# EAGLE design InteractionBoard_temp (EAGLE 9.6.2)
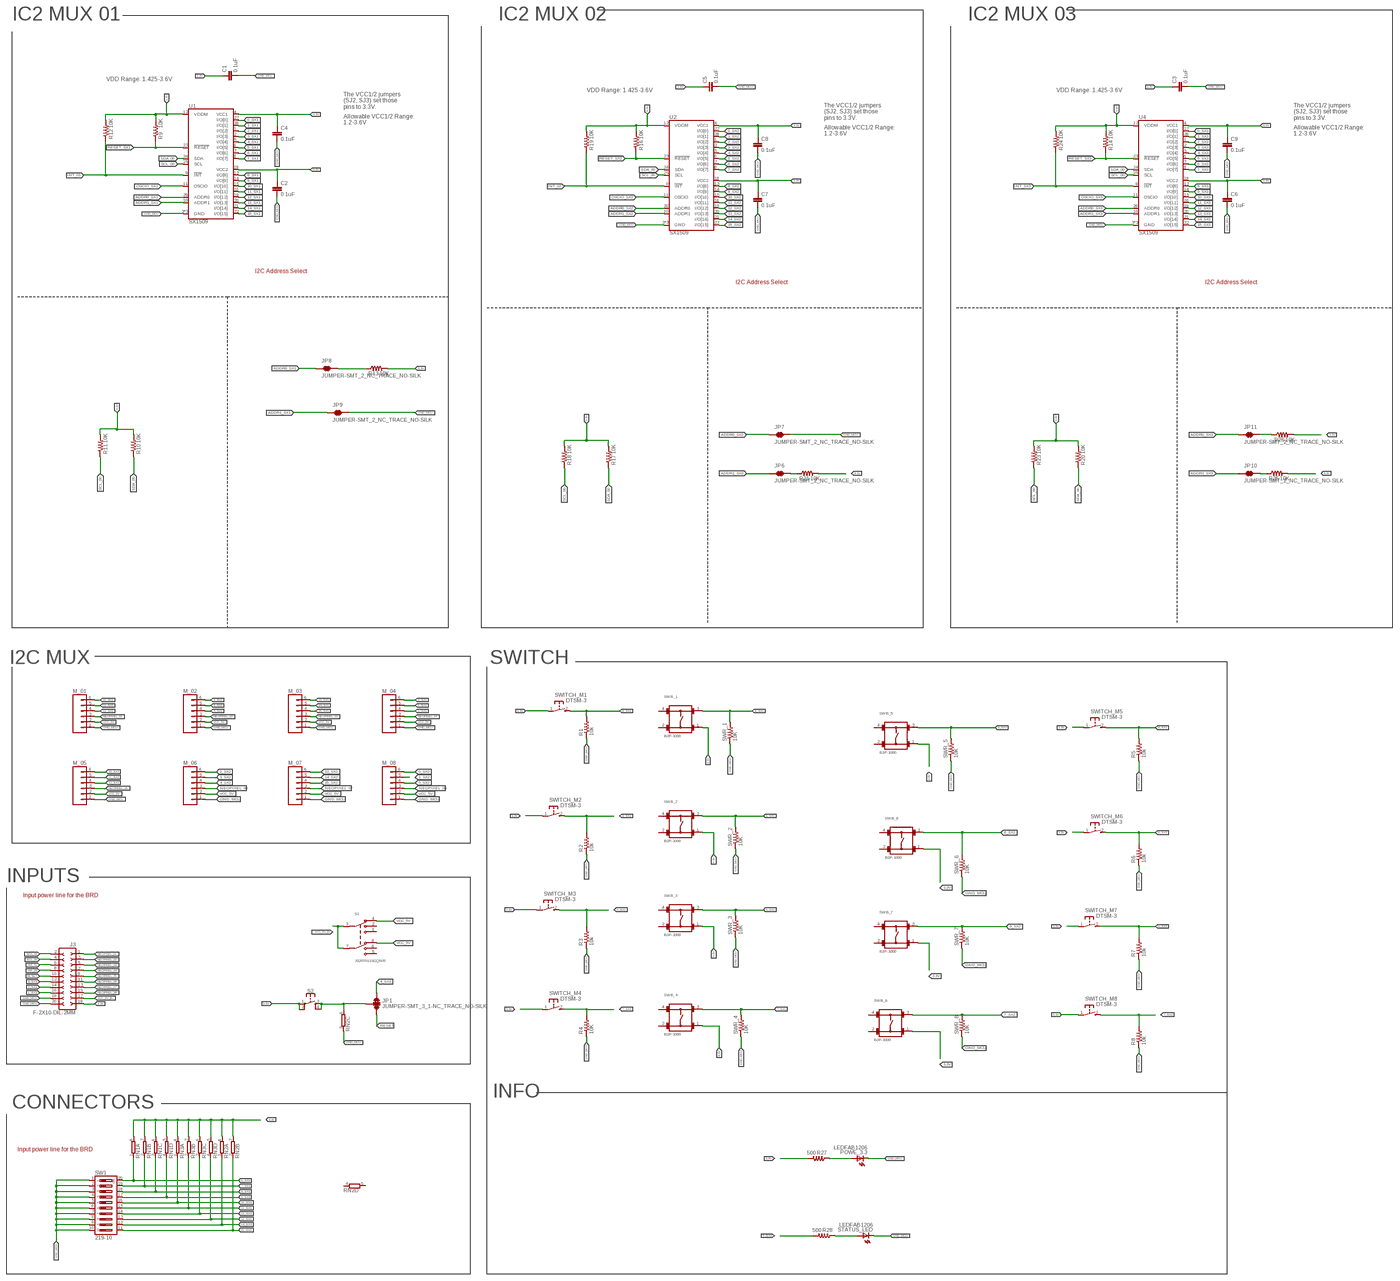
[diagram p0: schematic, sheet 1, overview]
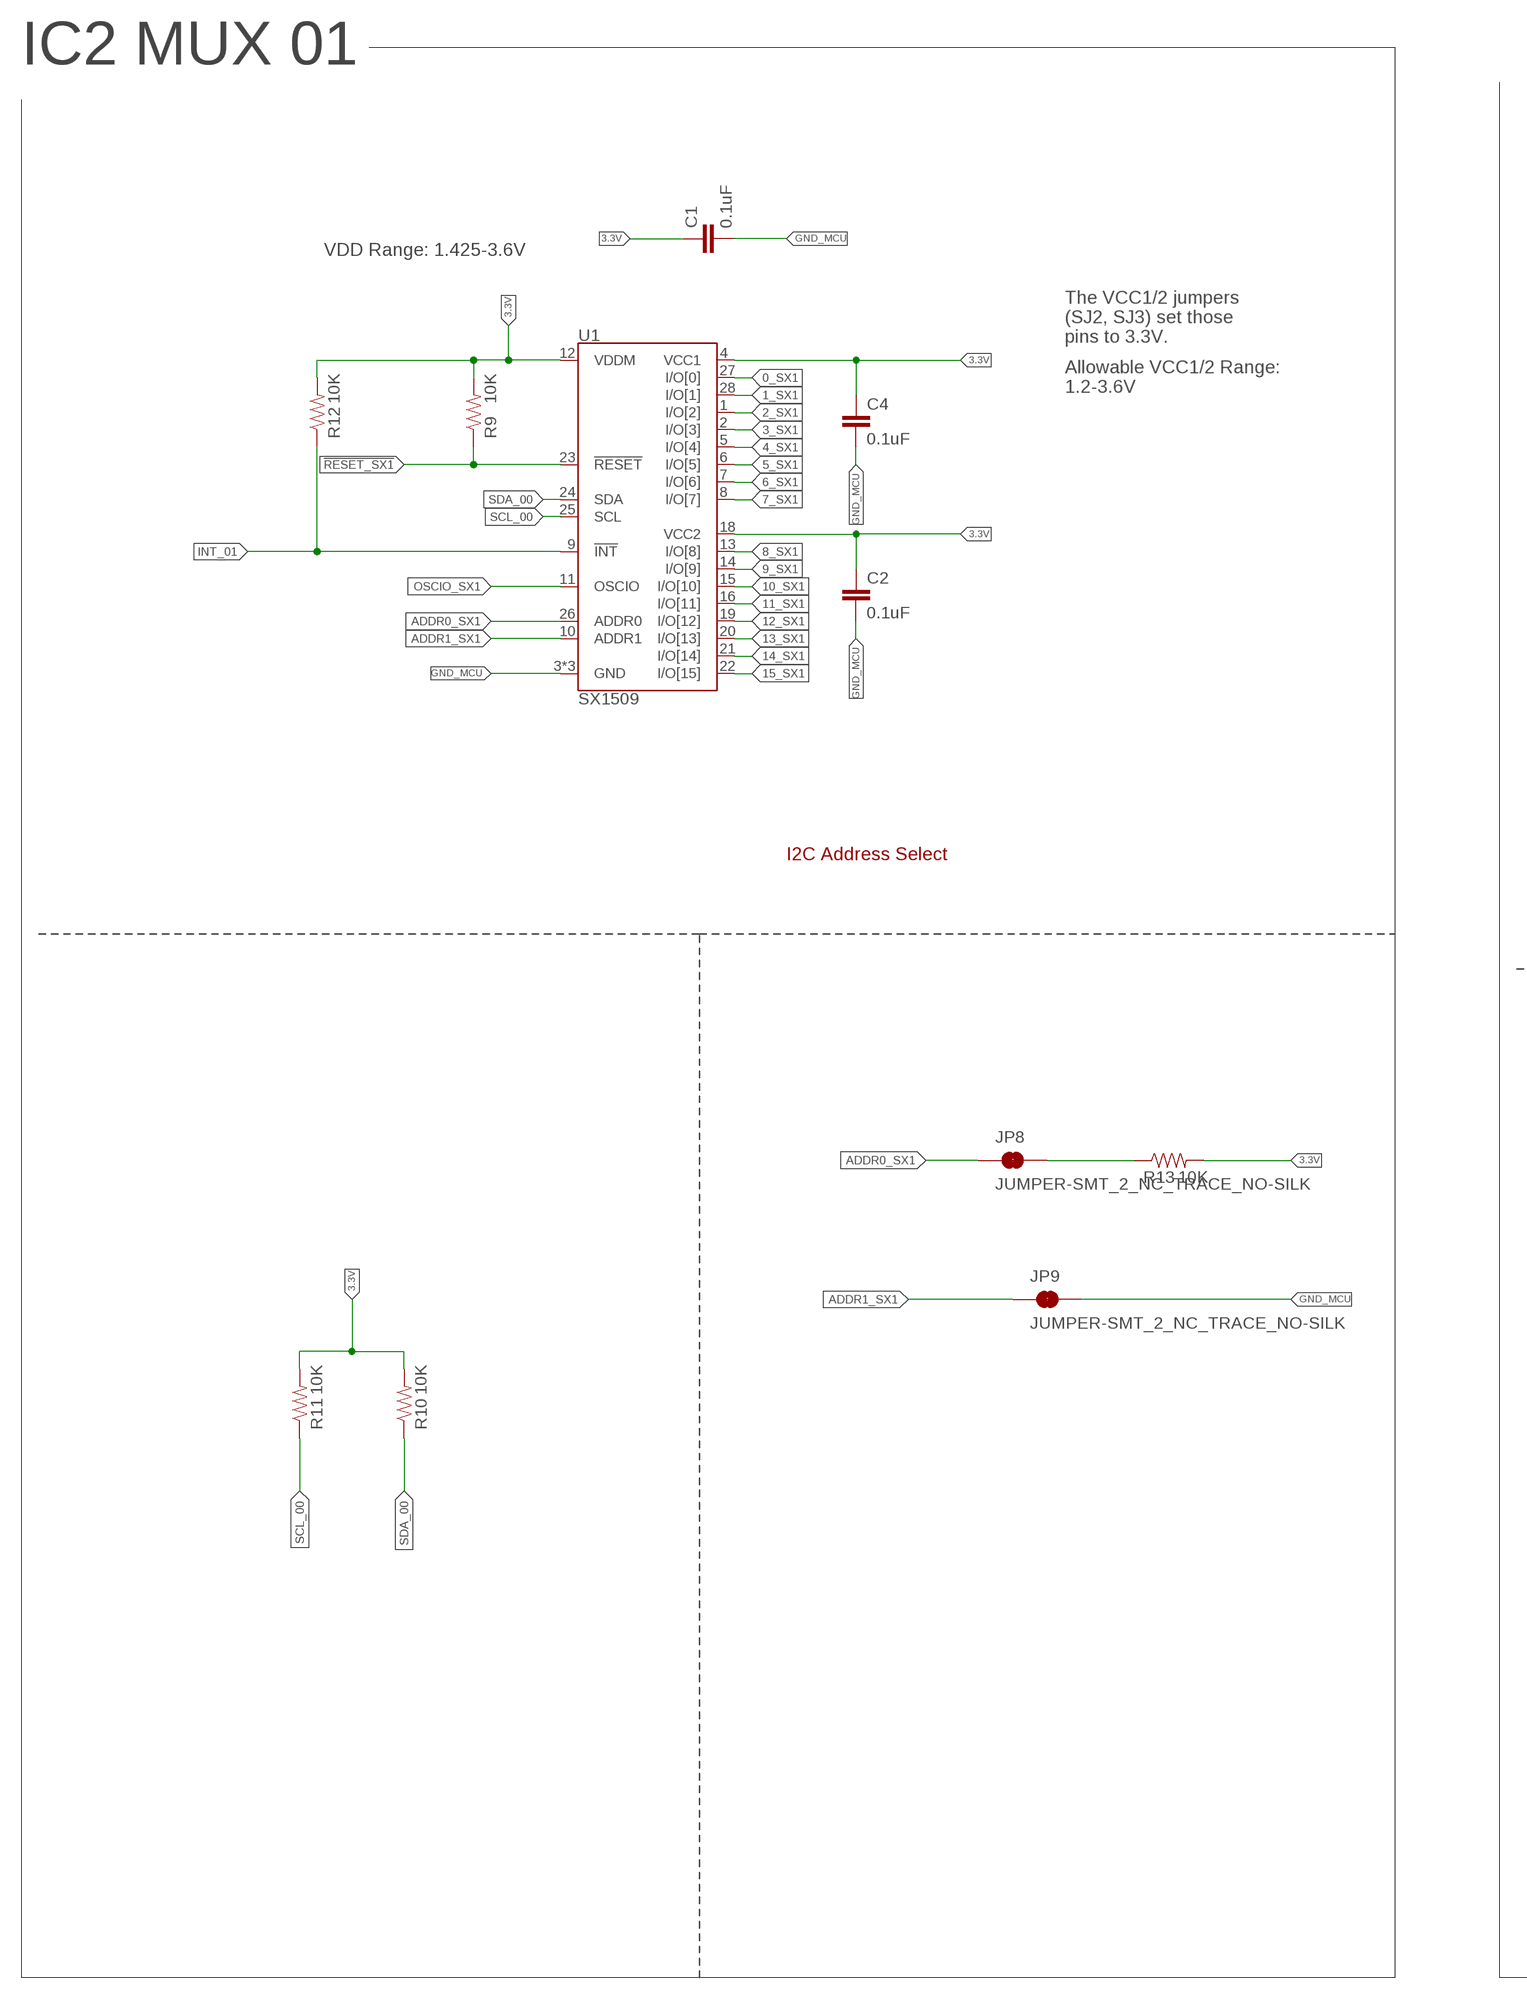
[diagram p1: schematic, sheet 1, part 1 of 4]
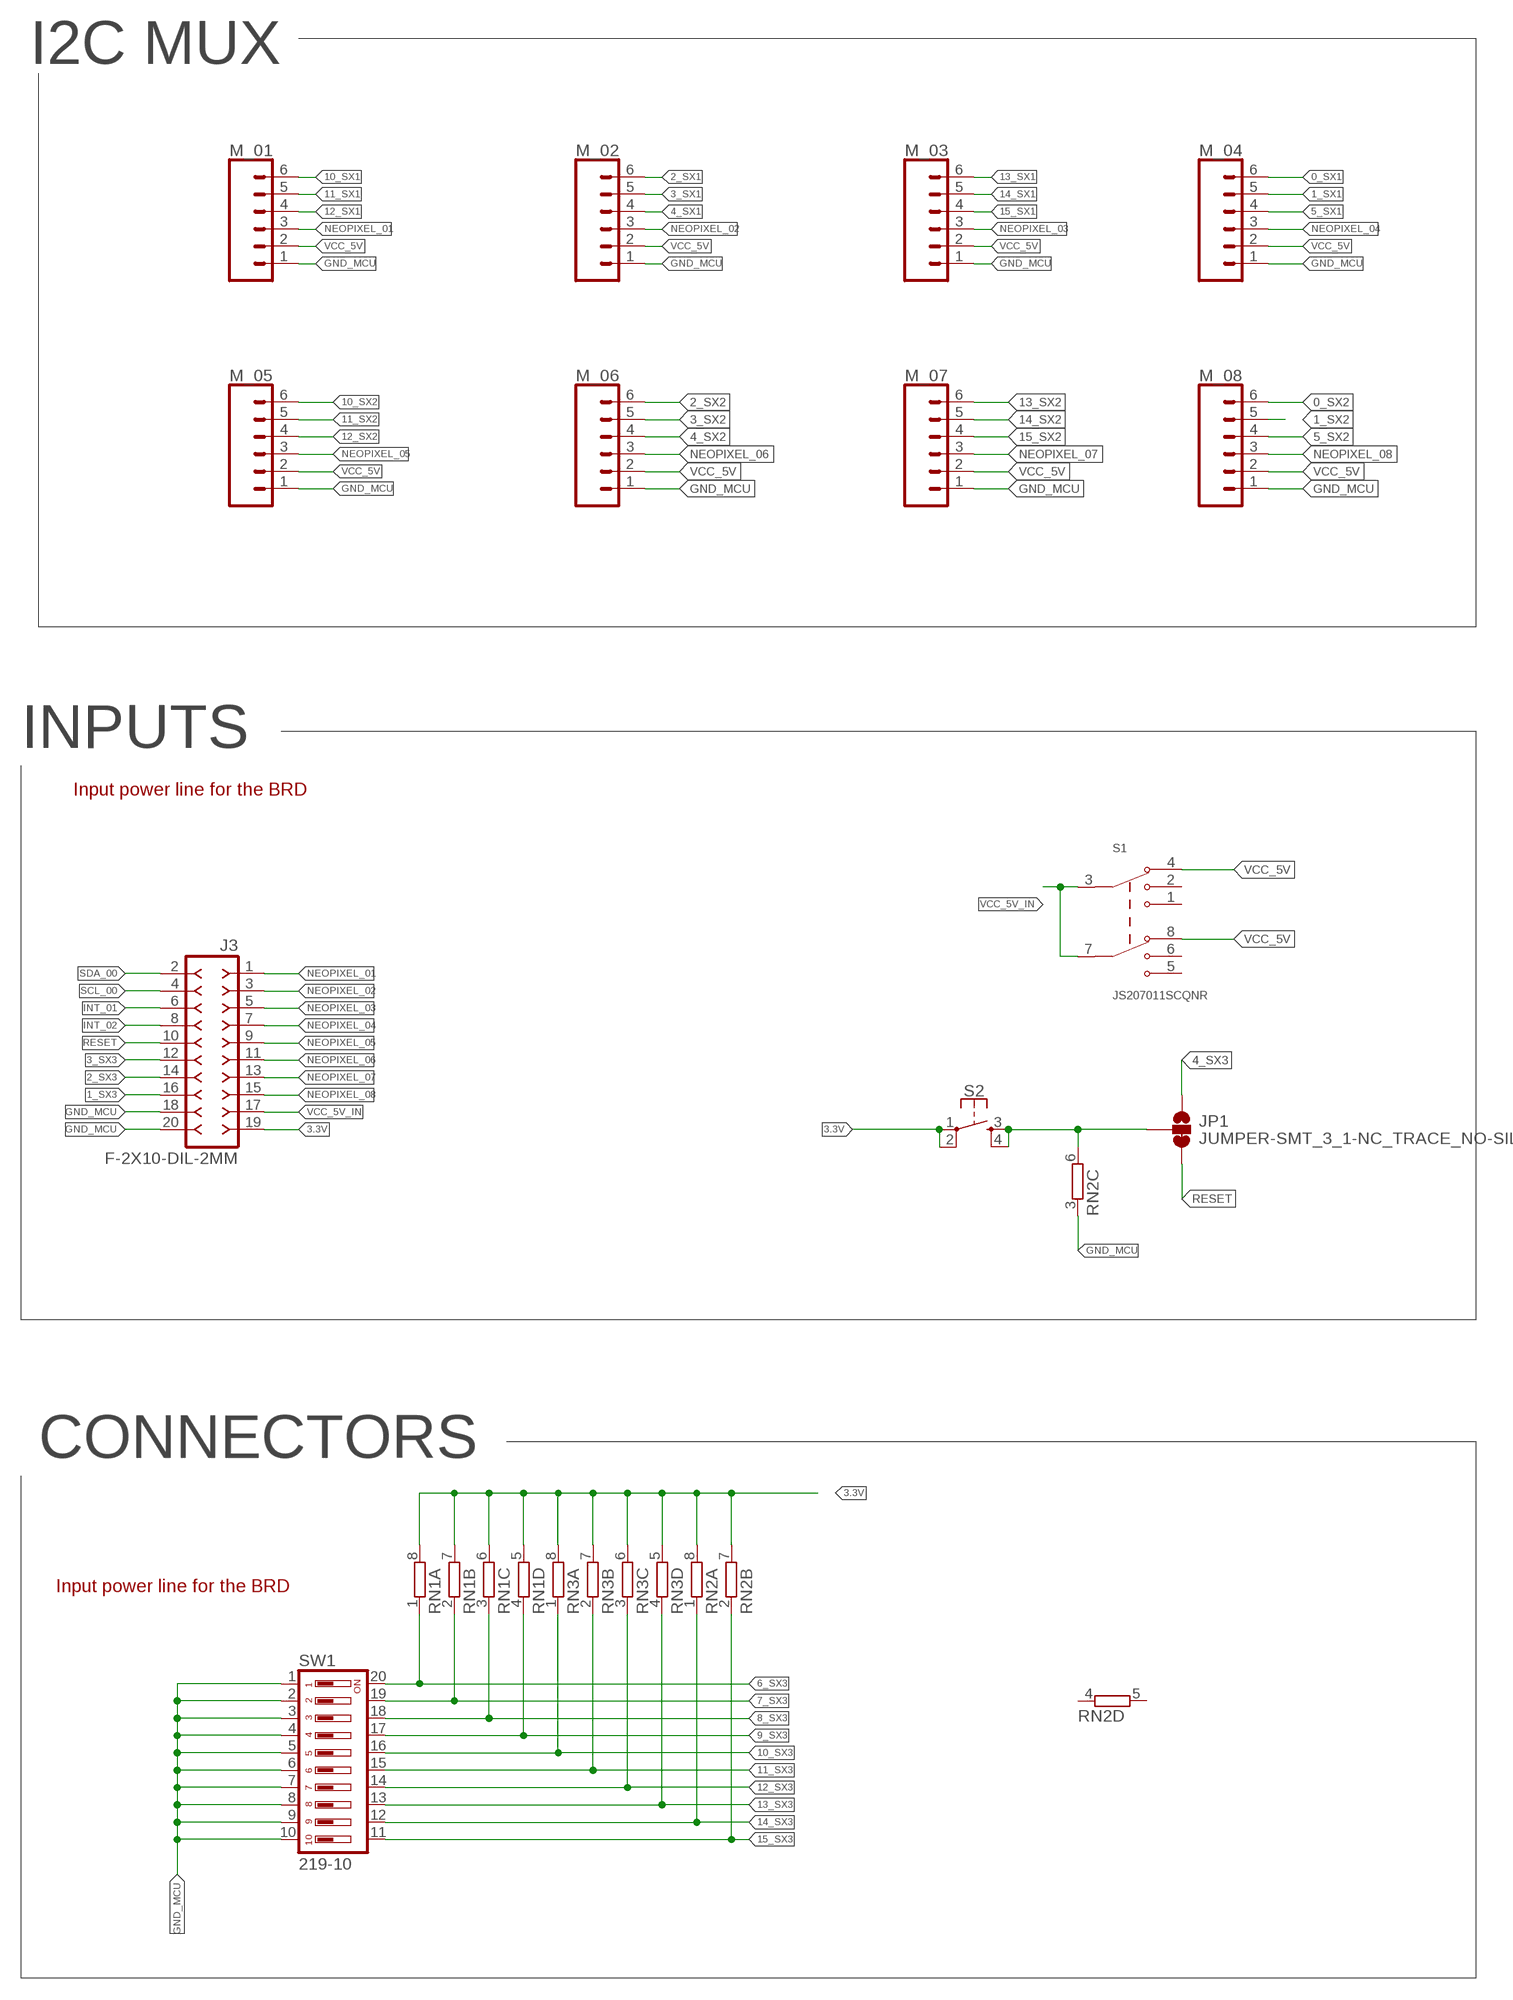
[diagram p2: schematic, sheet 1, part 2 of 4]
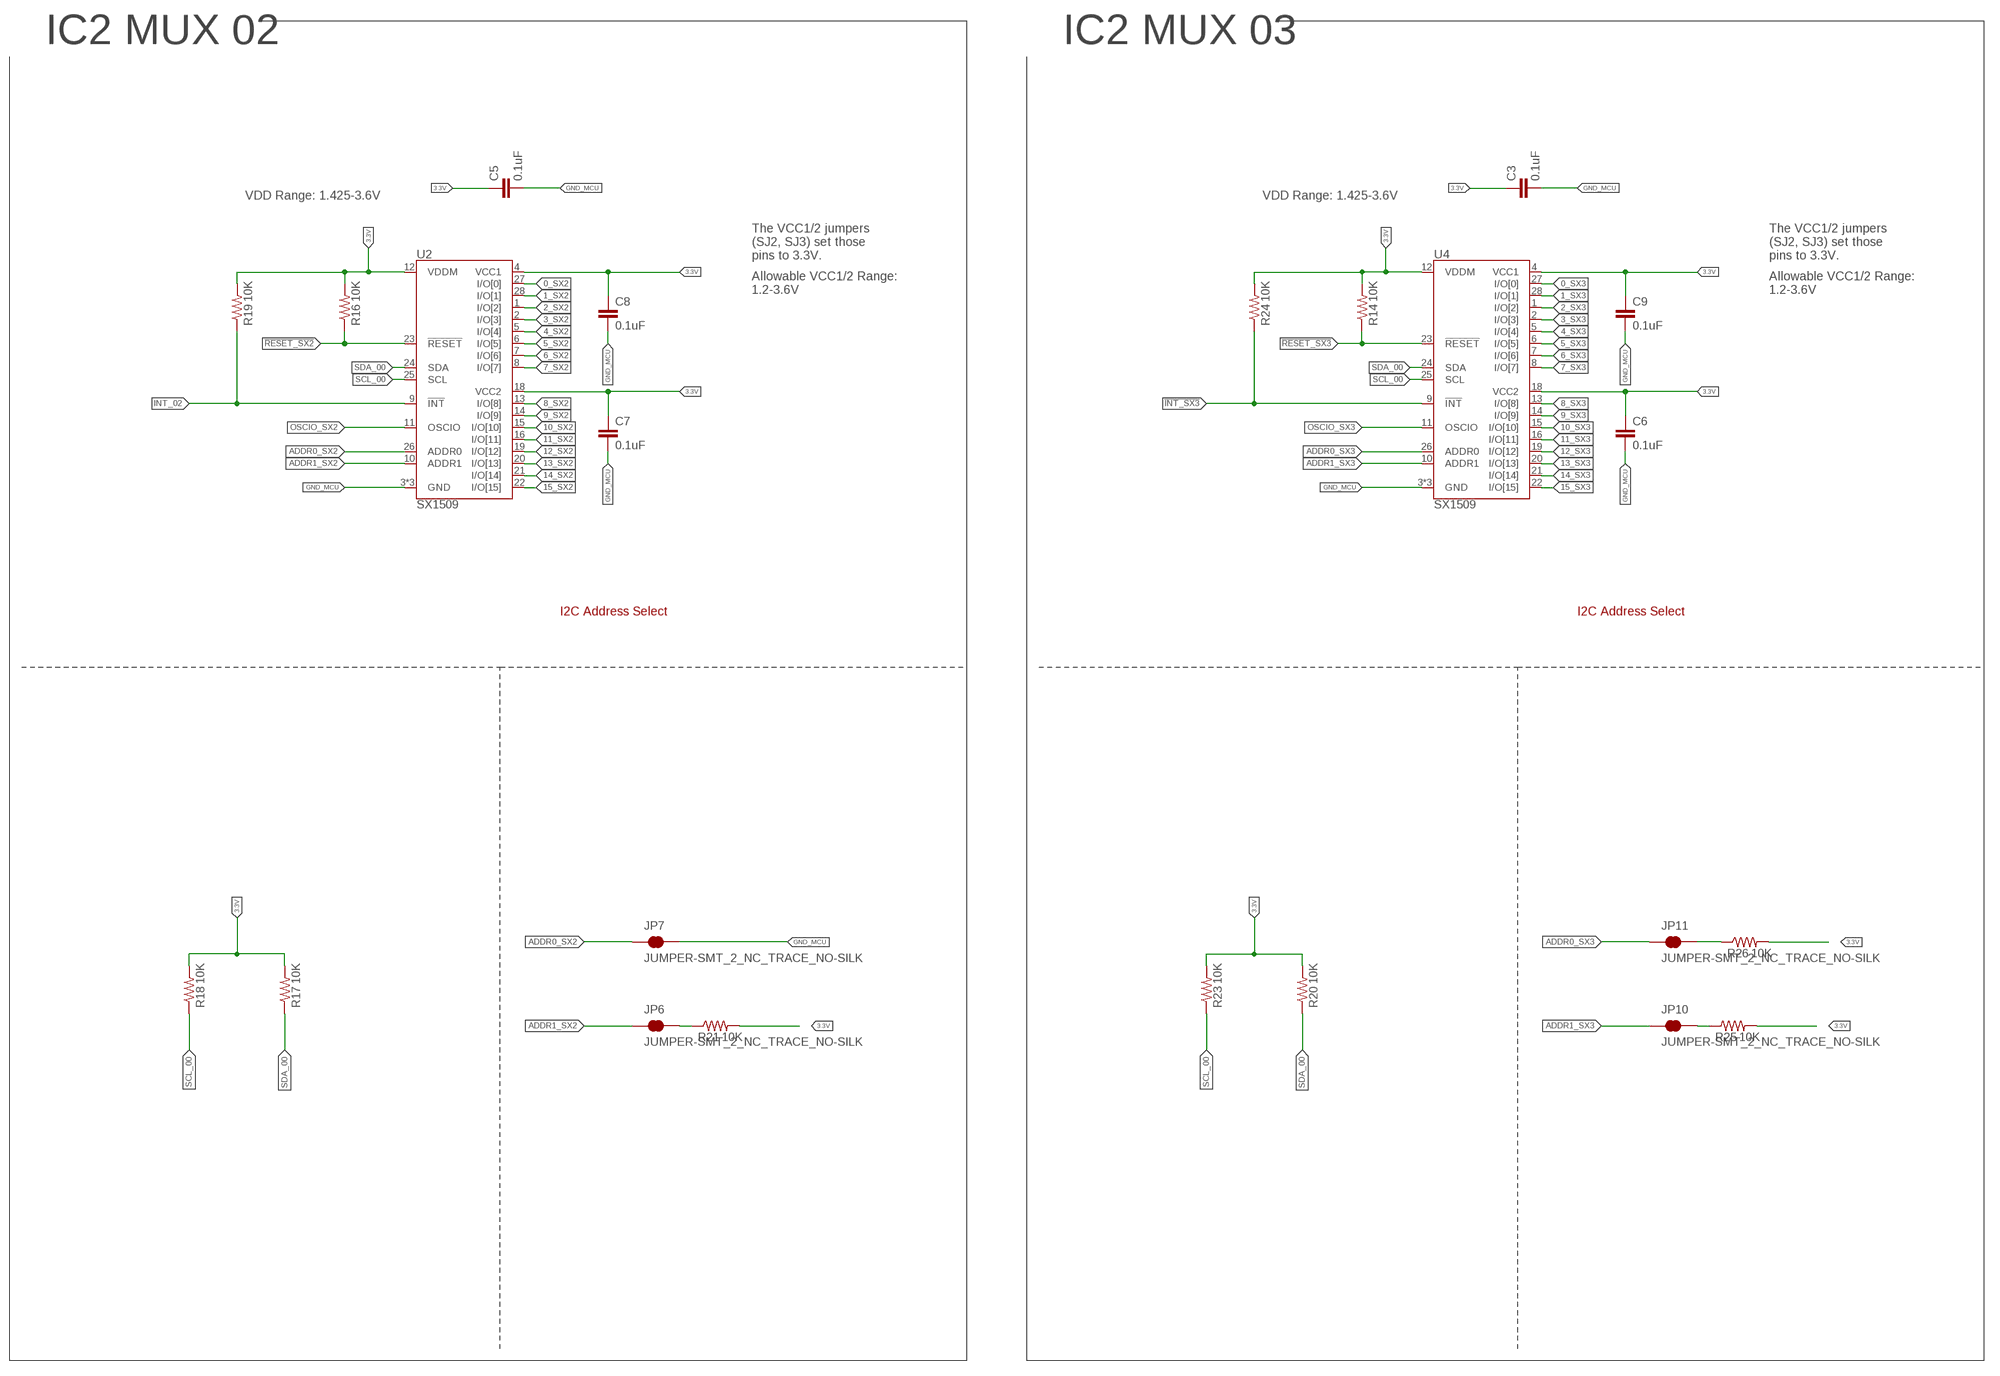
[diagram p3: schematic, sheet 1, part 3 of 4]
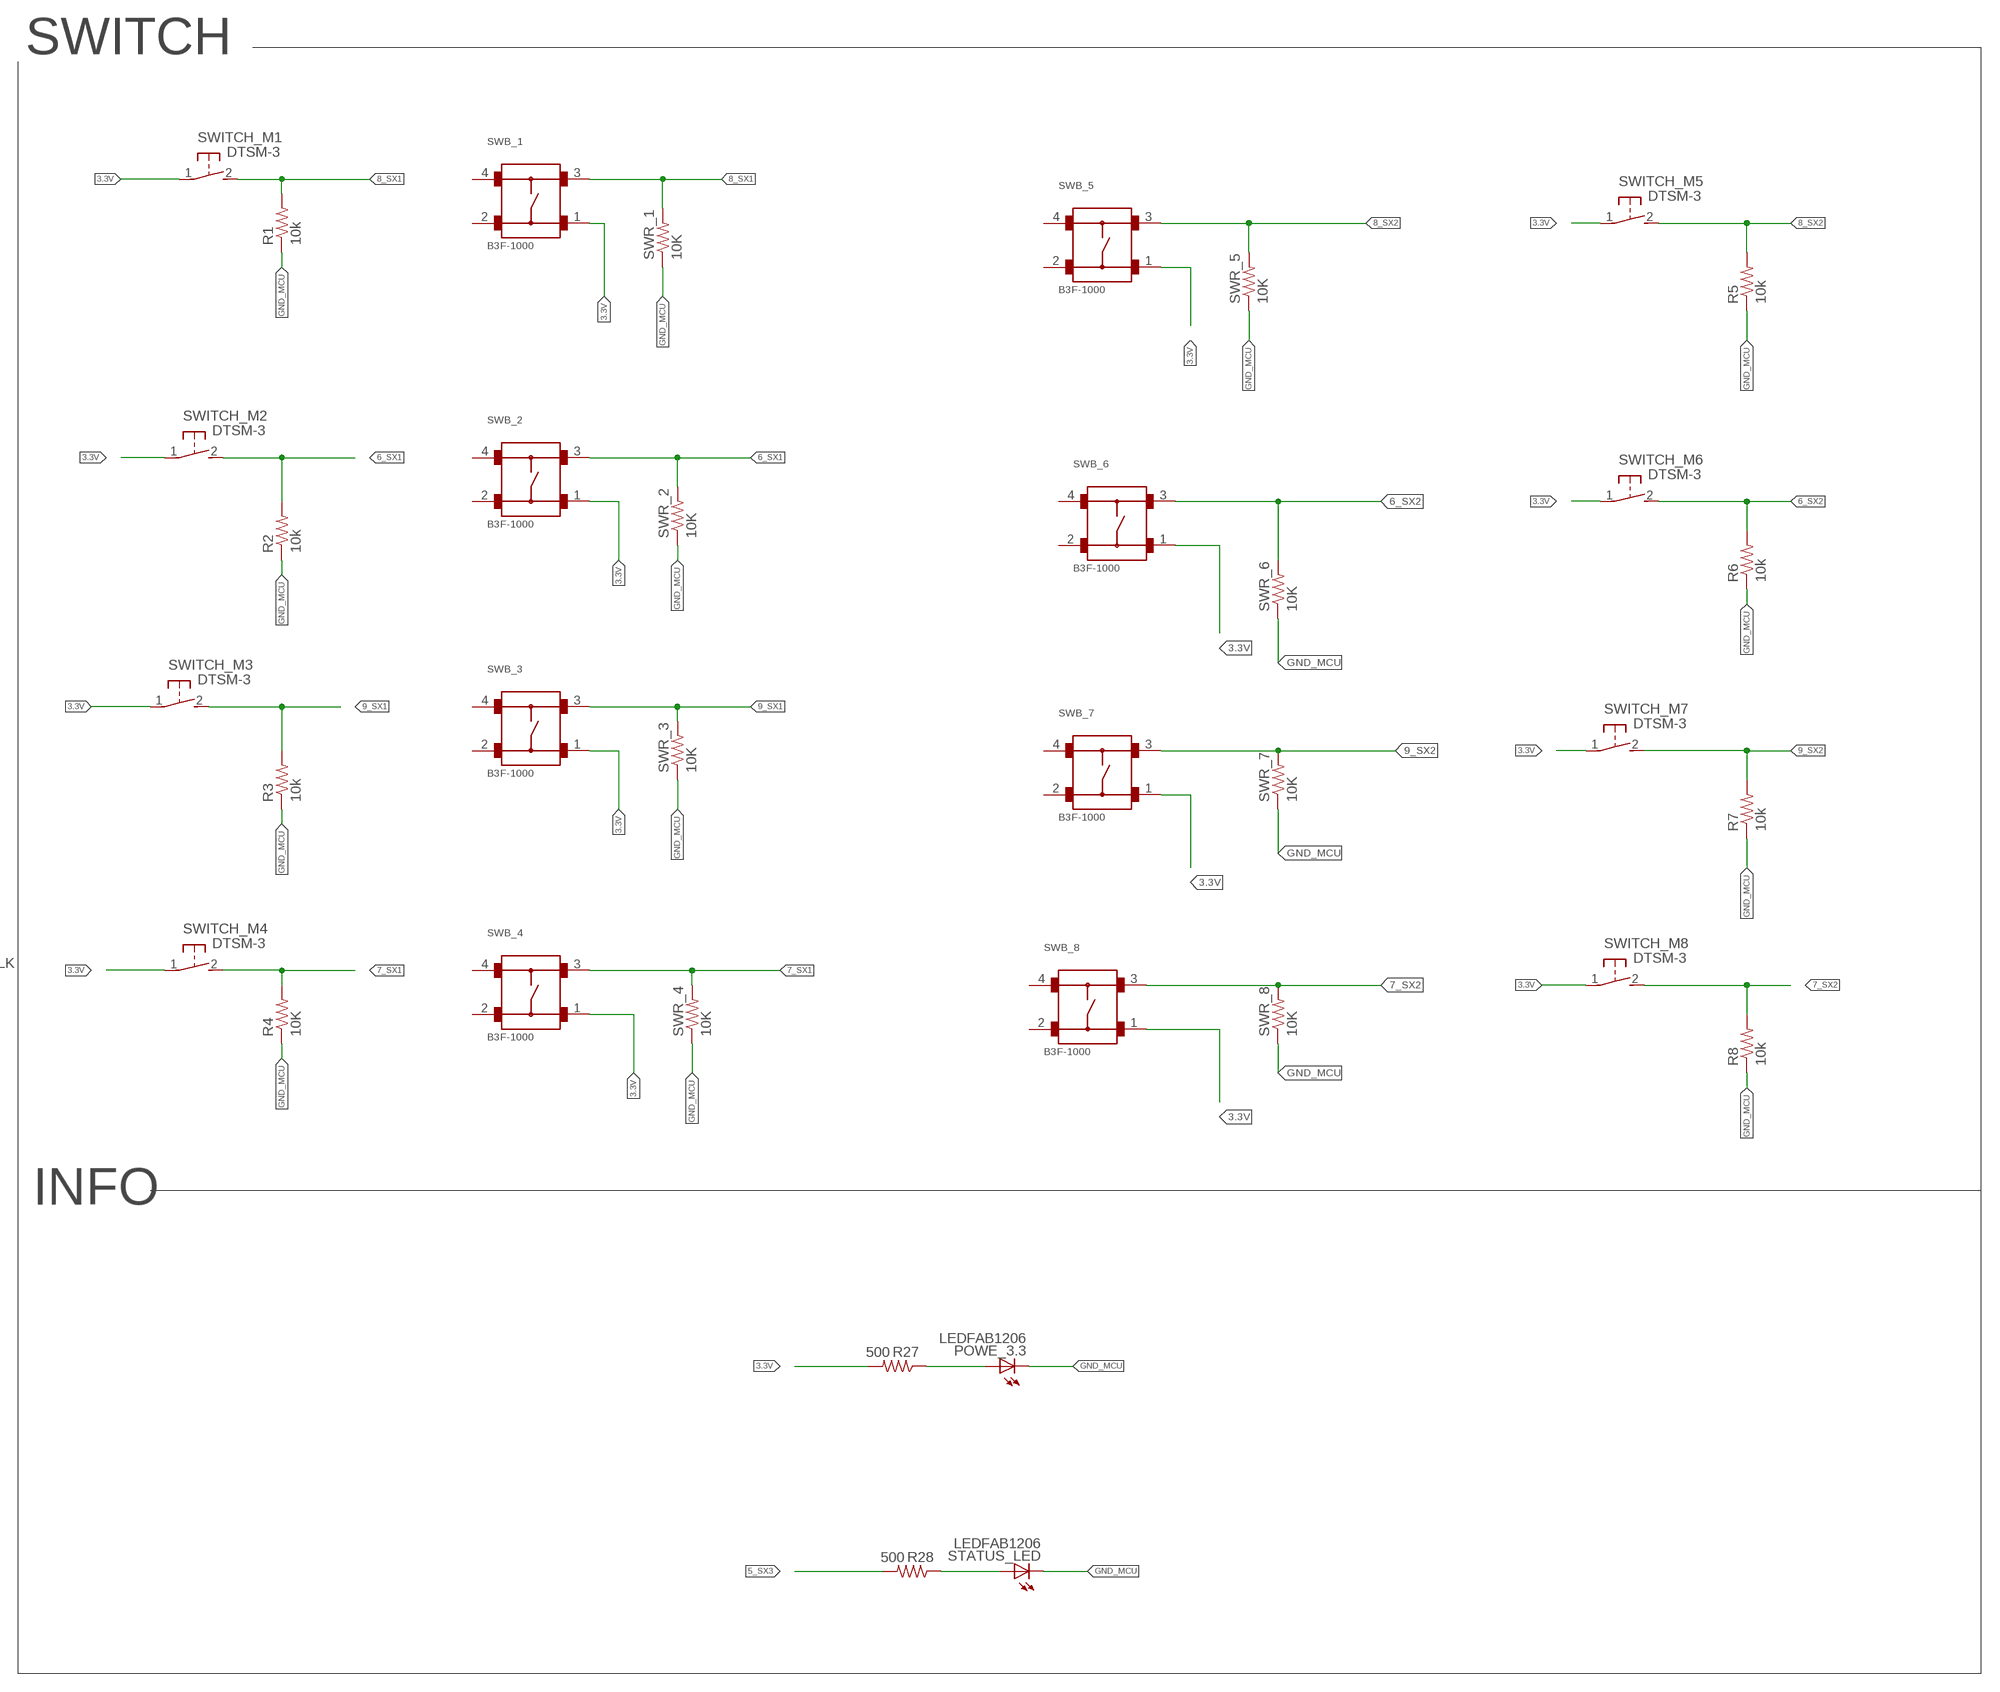
[diagram p4: schematic, sheet 1, part 4 of 4]

## Parts
C1  0.1uF  0.1UF-25V(+80/-20%)(0603)  [0603-CAP]
C2  0.1uF  0.1UF-25V(+80/-20%)(0603)  [0603-CAP]
C3  0.1uF  0.1UF-25V(+80/-20%)(0603)  [0603-CAP]
C4  0.1uF  0.1UF-25V(+80/-20%)(0603)  [0603-CAP]
C5  0.1uF  0.1UF-25V(+80/-20%)(0603)  [0603-CAP]
C6  0.1uF  0.1UF-25V(+80/-20%)(0603)  [0603-CAP]
C7  0.1uF  0.1UF-25V(+80/-20%)(0603)  [0603-CAP]
C8  0.1uF  0.1UF-25V(+80/-20%)(0603)  [0603-CAP]
C9  0.1uF  0.1UF-25V(+80/-20%)(0603)  [0603-CAP]
J3  F-2X10-DIL-2MM  [DIL-2MM-2X10]
JP1  JUMPER-SMT_3_1-NC_TRACE_NO-SILK  [SMT-JUMPER_3_1-NC_TRACE_NO-SILK]
JP6  JUMPER-SMT_2_NC_TRACE_NO-SILK  [SMT-JUMPER_2_NC_TRACE_NO-SILK]
JP7  JUMPER-SMT_2_NC_TRACE_NO-SILK  [SMT-JUMPER_2_NC_TRACE_NO-SILK]
JP8  JUMPER-SMT_2_NC_TRACE_NO-SILK  [SMT-JUMPER_2_NC_TRACE_NO-SILK]
JP9  JUMPER-SMT_2_NC_TRACE_NO-SILK  [SMT-JUMPER_2_NC_TRACE_NO-SILK]
JP10  JUMPER-SMT_2_NC_TRACE_NO-SILK  [SMT-JUMPER_2_NC_TRACE_NO-SILK]
JP11  JUMPER-SMT_2_NC_TRACE_NO-SILK  [SMT-JUMPER_2_NC_TRACE_NO-SILK]
M_01  CONN_06SMD-1MM  [1X06-1MM]
M_02  CONN_06SMD-1MM  [1X06-1MM]
M_03  CONN_06SMD-1MM  [1X06-1MM]
M_04  CONN_06SMD-1MM  [1X06-1MM]
M_05  CONN_06SMD-1MM  [1X06-1MM]
M_06  CONN_06SMD-1MM  [1X06-1MM]
M_07  CONN_06SMD-1MM  [1X06-1MM]
M_08  CONN_06SMD-1MM  [1X06-1MM]
POWE_3.3  LEDFAB1206  [LED1206FAB]
R1  10k  R-US_M0805  [M0805]
R2  10k  R-US_M0805  [M0805]
R3  10k  R-US_M0805  [M0805]
R4  10K  R-US_M0805  [M0805]
R5  10k  R-US_M0805  [M0805]
R6  10k  R-US_M0805  [M0805]
R7  10k  R-US_M0805  [M0805]
R8  10k  R-US_M0805  [M0805]
R9  10K  10KOHM-1/10W-1%(0603)0603  [0603-RES]
R10  10K  10KOHM-1/10W-1%(0603)0603  [0603-RES]
R11  10K  10KOHM-1/10W-1%(0603)0603  [0603-RES]
R12  10K  10KOHM-1/10W-1%(0603)0603  [0603-RES]
R13  10K  10KOHM-1/10W-1%(0603)0603  [0603-RES]
R14  10K  10KOHM-1/10W-1%(0603)0603  [0603-RES]
R16  10K  10KOHM-1/10W-1%(0603)0603  [0603-RES]
R17  10K  10KOHM-1/10W-1%(0603)0603  [0603-RES]
R18  10K  10KOHM-1/10W-1%(0603)0603  [0603-RES]
R19  10K  10KOHM-1/10W-1%(0603)0603  [0603-RES]
R20  10K  10KOHM-1/10W-1%(0603)0603  [0603-RES]
R21  10K  10KOHM-1/10W-1%(0603)0603  [0603-RES]
R23  10K  10KOHM-1/10W-1%(0603)0603  [0603-RES]
R24  10K  10KOHM-1/10W-1%(0603)0603  [0603-RES]
R25  10K  10KOHM-1/10W-1%(0603)0603  [0603-RES]
R26  10K  10KOHM-1/10W-1%(0603)0603  [0603-RES]
R27  500  10KOHM-1/10W-1%(0603)0603  [0603-RES]
R28  500  10KOHM-1/10W-1%(0603)0603  [0603-RES]
RN1  4R-NEXB38V  [EXB38V]
RN2  4R-NEXB38V  [EXB38V]
RN3  4R-NEXB38V  [EXB38V]
S1  JS207011SCQNR  [SW_JS207011SCQNR]
S2  MOMENTARY-SWITCH-SPST-2-SMD-5.2MM  [TACTILE_SWITCH_SMD_5.2MM]
STATUS_LED  LEDFAB1206  [LED1206FAB]
SW1  219-10  [CTS-219-10]
SWB_1  B3F-1000  [B3F-1000]
SWB_2  B3F-1000  [B3F-1000]
SWB_3  B3F-1000  [B3F-1000]
SWB_4  B3F-1000  [B3F-1000]
SWB_5  B3F-1000  [B3F-1000]
SWB_6  B3F-1000  [B3F-1000]
SWB_7  B3F-1000  [B3F-1000]
SWB_8  B3F-1000  [B3F-1000]
SWITCH_M1  DTSM-3  [DTSM-3]
SWITCH_M2  DTSM-3  [DTSM-3]
SWITCH_M3  DTSM-3  [DTSM-3]
SWITCH_M4  DTSM-3  [DTSM-3]
SWITCH_M5  DTSM-3  [DTSM-3]
SWITCH_M6  DTSM-3  [DTSM-3]
SWITCH_M7  DTSM-3  [DTSM-3]
SWITCH_M8  DTSM-3  [DTSM-3]
SWR_1  10K  R-US_M0805  [M0805]
SWR_2  10K  R-US_M0805  [M0805]
SWR_3  10K  R-US_M0805  [M0805]
SWR_4  10K  R-US_M0805  [M0805]
SWR_5  10K  R-US_M0805  [M0805]
SWR_6  10K  R-US_M0805  [M0805]
SWR_7  10K  R-US_M0805  [M0805]
SWR_8  10K  R-US_M0805  [M0805]
U1  SX1509  [QFN-28]
U2  SX1509  [QFN-28]
U4  SX1509  [QFN-28]

## Nets
0_SX1: M_04.6 U1.27(I/O[0])
0_SX2: M_08.6 U2.27(I/O[0])
0_SX3: U4.27(I/O[0])
1_SX1: M_04.5 U1.28(I/O[1])
1_SX2: M_08.5 U2.28(I/O[1])
1_SX3: J3.16 U4.28(I/O[1])
2_SX1: M_02.6 U1.1(I/O[2])
2_SX2: M_06.6 U2.1(I/O[2])
2_SX3: J3.14 U4.1(I/O[2])
3.3V [3v]: C1.1 C2.1 C3.1 C4.1 C5.1 C6.1 C7.1 C8.1 C9.1 J3.19 R9.2 R10.2 R11.2 R12.2 R13.2 R14.2 R16.2 R17.2 R18.2 R19.2 R20.2 R21.2 R23.2 R24.2 R25.2 R26.2 R27.2 RN1.5 RN1.6 RN1.7 RN1.8 RN2.7 RN2.8 RN3.5 RN3.6 RN3.7 RN3.8 S2.1 S2.2 SWB_1.1 SWB_2.1 SWB_3.1 SWB_4.1 SWB_5.1 SWB_6.1 SWB_7.1 SWB_8.1 SWITCH_M1.1 SWITCH_M2.1 SWITCH_M3.1 SWITCH_M4.1 SWITCH_M5.1 SWITCH_M6.1 SWITCH_M7.1 SWITCH_M8.1 U1.4(VCC1) U1.12(VDDM) U1.18(VCC2) U2.4(VCC1) U2.12(VDDM) U2.18(VCC2) U4.4(VCC1) U4.12(VDDM) U4.18(VCC2)
3_SX1: M_02.5 U1.2(I/O[3])
3_SX2: M_06.5 U2.2(I/O[3])
3_SX3: J3.12 U4.2(I/O[3])
4_SX1: M_02.4 U1.5(I/O[4])
4_SX2: M_06.4 U2.5(I/O[4])
4_SX3: JP1.1 U4.5(I/O[4])
5_SX1: M_04.4 U1.6(I/O[5])
5_SX2: M_08.4 U2.6(I/O[5])
5_SX3: R28.2 U4.6(I/O[5])
6_SX1: R2.2 SWB_2.3 SWITCH_M2.2 SWR_2.2 U1.7(I/O[6])
6_SX2: R6.2 SWB_6.3 SWITCH_M6.2 SWR_6.2 U2.7(I/O[6])
6_SX3: RN1.1 SW1.20 U4.7(I/O[6])
7_SX1: R4.2 SWB_4.3 SWITCH_M4.2 SWR_4.2 U1.8(I/O[7])
7_SX2: R8.2 SWB_8.3 SWITCH_M8.2 SWR_8.2 U2.8(I/O[7])
7_SX3: RN1.2 SW1.19 U4.8(I/O[7])
8_SX1: R1.2 SWB_1.3 SWITCH_M1.2 SWR_1.2 U1.13(I/O[8])
8_SX2: R5.2 SWB_5.3 SWITCH_M5.2 SWR_5.2 U2.13(I/O[8])
8_SX3: RN1.3 SW1.18 U4.13(I/O[8])
9_SX1: R3.2 SWB_3.3 SWITCH_M3.2 SWR_3.2 U1.14(I/O[9])
9_SX2: R7.2 SWB_7.3 SWITCH_M7.2 SWR_7.2 U2.14(I/O[9])
9_SX3: RN1.4 SW1.17 U4.14(I/O[9])
10_SX1: M_01.6 U1.15(I/O[10])
10_SX2: M_05.6 U2.15(I/O[10])
10_SX3: RN3.1 SW1.16 U4.15(I/O[10])
11_SX1: M_01.5 U1.16(I/O[11])
11_SX2: M_05.5 U2.16(I/O[11])
11_SX3: RN3.2 SW1.15 U4.16(I/O[11])
12_SX1: M_01.4 U1.19(I/O[12])
12_SX2: M_05.4 U2.19(I/O[12])
12_SX3: RN3.3 SW1.14 U4.19(I/O[12])
13_SX1: M_03.6 U1.20(I/O[13])
13_SX2: M_07.6 U2.20(I/O[13])
13_SX3: RN3.4 SW1.13 U4.20(I/O[13])
14_SX1: M_03.5 U1.21(I/O[14])
14_SX2: M_07.5 U2.21(I/O[14])
14_SX3: RN2.1 SW1.12 U4.21(I/O[14])
15_SX1: M_03.4 U1.22(I/O[15])
15_SX2: M_07.4 U2.22(I/O[15])
15_SX3: RN2.2 SW1.11 U4.22(I/O[15])
!INT_SX3: R24.1 U4.9(!INT)
!RESET_SX1: R9.1 U1.23(!RESET)
!RESET_SX2: R16.1 U2.23(!RESET)
!RESET_SX3: R14.1 U4.23(!RESET)
ADDR0_SX1: JP8.1 U1.26(ADDR0)
ADDR0_SX2: JP7.1 U2.26(ADDR0)
ADDR0_SX3: JP11.1 U4.26(ADDR0)
ADDR1_SX1: JP9.1 U1.10(ADDR1)
ADDR1_SX2: JP6.1 U2.10(ADDR1)
ADDR1_SX3: JP10.1 U4.10(ADDR1)
GND_MCU: C1.2 C2.2 C3.2 C4.2 C5.2 C6.2 C7.2 C8.2 C9.2 J3.18 J3.20 JP7.2 JP9.2 M_01.1 M_02.1 M_03.1 M_04.1 M_05.1 M_06.1 M_07.1 M_08.1 POWE_3.3.2(C) R1.1 R2.1 R3.1 R4.1 R5.1 R6.1 R7.1 R8.1 RN2.3 STATUS_LED.2(C) SW1.1 SW1.2 SW1.3 SW1.4 SW1.5 SW1.6 SW1.7 SW1.8 SW1.9 SW1.10 SWR_1.1 SWR_2.1 SWR_3.1 SWR_4.1 SWR_5.1 SWR_6.1 SWR_7.1 SWR_8.1 U1.3(GND) U1.17(GND) U1.29(GND) U2.3(GND) U2.17(GND) U2.29(GND) U4.3(GND) U4.17(GND) U4.29(GND)
INT_01: J3.6 R12.1 U1.9(!INT)
INT_02: J3.8 R19.1 U2.9(!INT)
N$5: JP6.2 R21.1
N$8: JP8.2 R13.1
N$13: R28.1 STATUS_LED.1(A)
N$14: JP10.2 R25.1
N$15: JP11.2 R26.1
N$193: POWE_3.3.1(A) R27.1
NEOPIXEL_01: J3.1 M_01.3
NEOPIXEL_02: J3.3 M_02.3
NEOPIXEL_03: J3.5 M_03.3
NEOPIXEL_04: J3.7 M_04.3
NEOPIXEL_05: J3.9 M_05.3
NEOPIXEL_06: J3.11 M_06.3
NEOPIXEL_07: J3.13 M_07.3
NEOPIXEL_08: J3.15 M_08.3
OSCIO_SX1: U1.11(OSCIO)
OSCIO_SX2: U2.11(OSCIO)
OSCIO_SX3: U4.11(OSCIO)
RESET: J3.10 JP1.2 JP1.3 RN2.6 S2.3 S2.4
SCL_00: J3.4 R11.1 R18.1 R23.1 U1.25(SCL) U2.25(SCL) U4.25(SCL)
SDA_00: J3.2 R10.1 R17.1 R20.1 U1.24(SDA) U2.24(SDA) U4.24(SDA)
VCC_5V [5v]: M_01.2 M_02.2 M_03.2 M_04.2 M_05.2 M_06.2 M_07.2 M_08.2 S1.4 S1.8
VCC_5V_IN [5v]: J3.17 S1.3 S1.7
Unconnected: RN2.4 RN2.5 S1.1 S1.2 S1.5 S1.6 SWB_1.2 SWB_1.4 SWB_2.2 SWB_2.4 SWB_3.2 SWB_3.4 SWB_4.2 SWB_4.4 SWB_5.2 SWB_5.4 SWB_6.2 SWB_6.4 SWB_7.2 SWB_7.4 SWB_8.2 SWB_8.4

## Notes on the sheet
- IC2 MUX 01 | IC2 MUX 02 | IC2 MUX 03
- VDD Range: 1.425-3.6V
- VDD Range: 1.425-3.6V | VDD Range: 1.425-3.6V
- The VCC1/2 jumpers 
  (SJ2, SJ3) set those 
  pins to 3.3V.
- Allowable VCC1/2 Range: 
  1.2-3.6V
- The VCC1/2 jumpers 
  (SJ2, SJ3) set those 
  pins to 3.3V.
- The VCC1/2 jumpers 
  (SJ2, SJ3) set those 
  pins to 3.3V.
- Allowable VCC1/2 Range: 
  1.2-3.6V
- Allowable VCC1/2 Range: 
  1.2-3.6V
- I2C Address Select
- I2C Address Select | I2C Address Select
- I2C MUX | SWITCH
- INPUTS
- Input power line for the BRD
- INFO
- CONNECTORS
- Input power line for the BRD

## Library data of the parts
C1-C9 = SparkFun-Capacitors:0.1UF-25V(+80/-20%)(0603): CAP-00810 Ceramic Standard decoupling cap; PROD_ID: CAP-00810
J3 = con-headers-jp:F-2X10-: FEMALE HEADER
JP1 = SparkFun-Jumpers:JUMPER-SMT_3_1-NC_TRACE: Normally closed trace jumper (1 of 2 connections) This jumper has a trace between two pads so it's normally closed (NC). The other connection is normally open (NO). Use a razor knife to open the connection. For best results follow the IPC guidelines for cutting traces: Cutout at least 0.063 mm (0.005 in). Remove all loose material to clean up the cut area. Seal the cut with an approved epoxy. Reapply solder to reclose the connection, or to close the NO connection.
JP6-JP11 = SparkFun-Jumpers:JUMPER-SMT_2_NC_TRACE: Normally closed trace jumper This jumper has a trace between two pads so it's normally closed (NC). Use a razor knife to open the connection. For best results follow the IPC guidelines for cutting traces: Cutout at least 0.063 mm (0.005 in). Remove all loose material to clean up the cut area. Seal the cut with an approved epoxy. Reapply solder to reclose the connection.
M_01-M_08 = SparkFun-Connectors:CONN_06: Multi connection point. Often used as Generic Header-pin footprint for 0.1 inch spaced/style header connections On any of the 0.1 inch spaced packages, you can populate with these: Break Away Headers - Straight <https://www.sparkfun.com/products/116> (PRT-00116) Break Away Male Headers - Right Angle <https://www.sparkfun.com/products/553> (PRT-00553) Female Headers <https://www.sparkfun.com/products/115> (PRT-00115) Break Away Headers - Machine Pin <https://www.sparkfun.com/products/117> (PRT-00117) Break Away Female Headers - Swiss Machine Pin <https://www.sparkfun.com/products/743> (PRT-00743) Arduino Stackable Header - 6 Pin <https://www.sparkfun.com/products/9280> (PRT-09280) For SCREWTERMINALS and SPRING TERMINALS visit here: Screw Terimnals on SparkFun.com <https://www.sparkfun.com/search/results?term=Screw+Terminals> (5mm/3.5mm/2.54mm spacing) This device is also useful as a general connection point to wire up your design to another part of your project. Our various solder wires solder well into these plated through hole pads. Hook-Up Wire - Assortment (Stranded, 22 AWG) <https://www.sparkfun.com/products/11375> (PRT-11375) Hook-Up Wire - Assortment (Solid Core, 22 AWG) <https://www.sparkfun.com/products/11367> (PRT-11367) View the entire wire category on our website here <https://www.sparkfun.com/categories/141>; PROD_ID: CONN-08249; SF_ID: GPS-00579
POWE_3.3 STATUS_LED = fab:LED: LED
R1-R8 SWR_1-SWR_8 = resistor:R-US_: RESISTOR, American symbol
R9-R14 R16-R21 R23-R26 = SparkFun-Resistors:10KOHM-1/10W-1%(0603): RES-00824; PROD_ID: RES-00824
R27 R28 = SparkFun-Resistors:10KOHM-1/10W-1%(0603): RES-00824; PROD_ID: RES-00824; VALUE: 10K
RN1-RN3 = resistor-dil:4R-N: Array Chip Resistor Source: RS Component / Phycomp; OC_FARNELL: unknown; OC_NEWARK: unknown
S1 = JS207011SCQNR:JS207011SCQNR: Js Series Sub-Miniature Slide Switches; AVAILABILITY: Unavailable; DESCRIPTION: Slide Switch DP3T Surface Mount; MF: C&K; MP: JS207011SCQNR; PACKAGE: None; PRICE: None
S2 = SparkFun-Switches:MOMENTARY-SWITCH-SPST-2: Momentary Switch (Pushbutton) - SPST - Two Circuits Normally-open (NO) SPST momentary switches (buttons, pushbuttons). Schematic symbol includes two switch circuits. Variants SMD-4.6MMX2.8MM - 4.60mm x 2.80mm Tactile Momentary Button Switch - Used on SparkFun SAMD21 Mini Breakout <https://www.sparkfun.com/products/13664> SMD-5.2MM - Mini Pushbutton Switch - SMD <https://www.sparkfun.com/products/8720> - Used on Arduino Pro Mini <https://www.sparkfun.com/products/11114>; PROD_ID: SWCH-08247; SF_SKU: COM-08720
SW1 = switch-dil:219-10*: Surface Mount DIP Switch Series 219 SMT CTS Electronic Components Sourc: www.ctscorp.com; MF: SLI (CML/IDI); MPN: 219-10PK; OC_FARNELL: unknown; OC_NEWARK: 19M0224
SWB_1-SWB_8 = Switch:B3F-1000: Tactile Switch SPST-NO Top Actuated Through Hole Manufacturer's datasheet <https://omronfs.omron.com/en_US/ecb/products/pdf/en-b3f.pdf>; CREATED_BY: PCBLayout.com; DIGI_KEY_PART_NUMBER: SW400-ND; MANUFACTURER: Omron Electronics Inc-EMC Div; MPN: B3F-1000; PACKAGE: SPST-NO
SWITCH_M1-SWITCH_M8 = switch-tact:DTSM-3
U1 U2 U4 = SparkFun-DigitalIC:SX1509: Semtech SX1509 The SX1509 is a complete ultra low voltage 1.2V to 3.6V General Purpose parallel Input/Output (GPIO) expanders ideal for low power handheld battery powered equipment. This version comes in a 16-channel configuration and allows easy serial expansion of I/O through a standard 400kHz I2C interface. GPIO devices can provide additional control and monitoring when the microcontroller or chipset has insufficient I/O ports, or in systems where serial communication and control from a remote location is advantageous.; PROD_ID: IC-11311

## Net classes
0 default: width 0.2 mm, clearance 0.2 mm
1 gnd: width 0.2 mm, clearance 0.2 mm to class 0, clearance 0.2 mm
2 3v: width 0.2 mm, clearance 0.2 mm
4 5v: width 0.4 mm, clearance 0.2 mm to class 0, clearance 0.2 mm

## Board
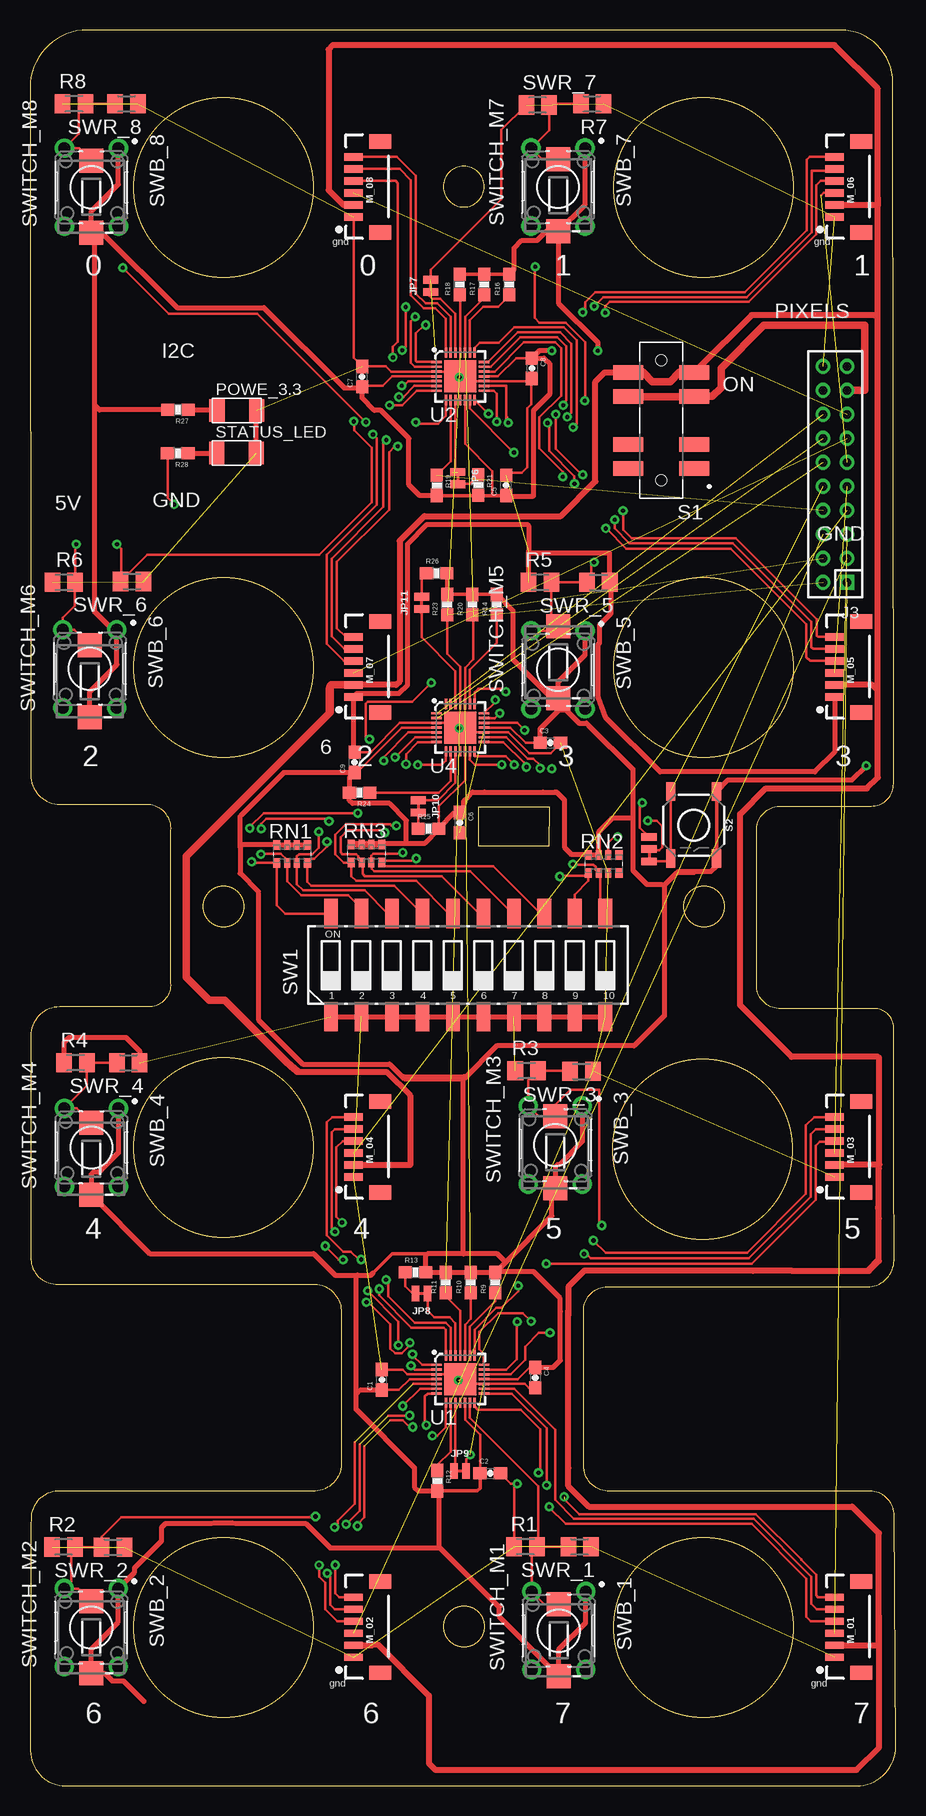
[diagram p5: board, top side]
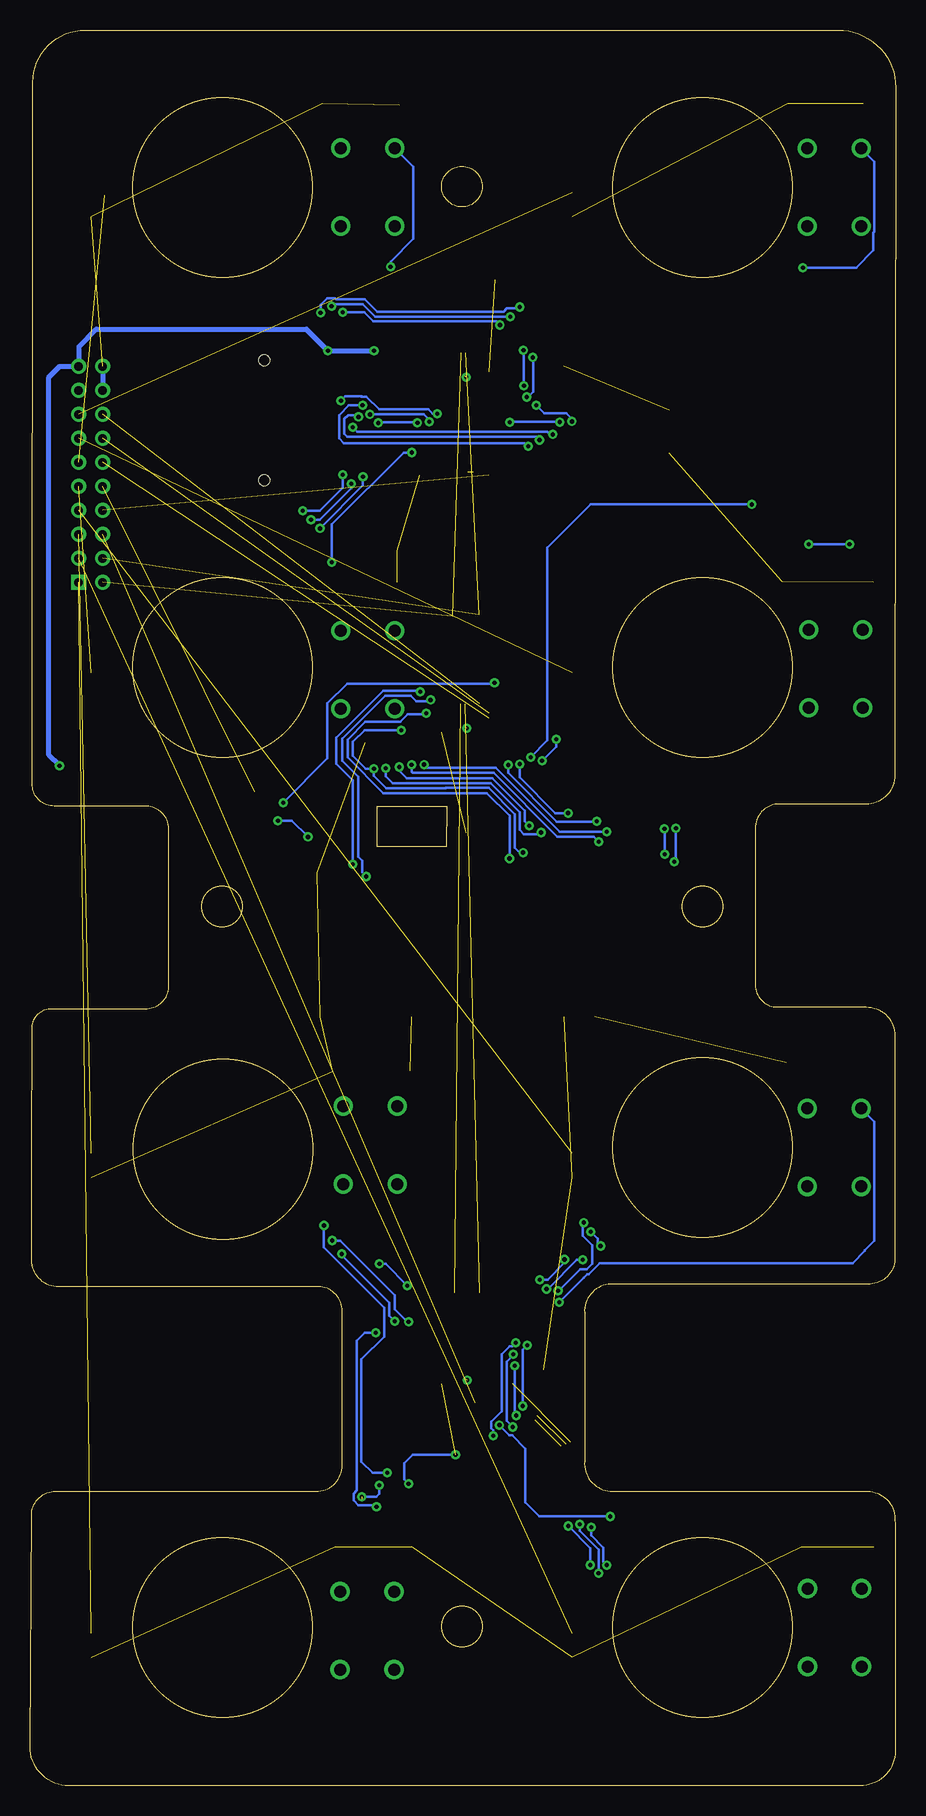
[diagram p6: board, bottom side, seen from below]

Size 72.14 x 146.32 mm. Coordinates in mm from the lower left corner, seen from the top.
Outline: 43.23,78.29 37.39,78.28 37.37,81.58 43.26,81.59 43.23,78.29
Outline: 71.97,63.21 arc87 70.33,64.77 62.38,64.77 arc-90 60.56,66.74 60.56,79.56 arc-90 62.44,81.65 70.11,81.65 arc90 71.96,83.5 71.9,141.95 arc90 67.53,146.32 4.8,146.32 arc90 0,141.52 0.06,84.23 arc90 2.49,81.8 9.88,81.8 arc-90 11.7,79.61 11.7,66.89 arc-90 10.02,64.9 2.46,64.9 arc90 0.06,62.5 0.06,43.87 arc90 2.34,41.81 23.74,41.81 arc-90 25.93,39.41 25.93,27.03 arc-90 23.77,24.54 2.57,24.54 arc88 0.09,22.48 0.05,21.53 0.05,10.47 0.03,10.09 0.03,2.92 arc90 2.96,0 68.89,0.01 arc90 72.14,3.28 72.01,22.71 arc90 69.81,24.54 48.12,24.54 arc-90 46.13,26.89 46.13,39.57 arc-90 48.11,41.58 69.76,41.58 arc90 72,43.79 72,47.47 71.99,47.79 71.99,52.59 71.98,52.95 71.98,57.82 71.97,58.14 71.97,63.21
Outline: 36.15,131.57 arc180 36.15,134.97 arc180 36.15,131.57
Outline: circle at 16.12,73.26 radius 1.7
Outline: circle at 36.16,13.27 radius 1.7
Outline: circle at 56.16,73.28 radius 1.7
Outline: circle at 16.12,13.2 radius 7.49
Outline: circle at 16.12,53.2 radius 7.49
Outline: circle at 16.12,133.2 radius 7.49
Outline: circle at 56.12,93.2 radius 7.49
Outline: circle at 56.12,133.2 radius 7.49
Outline: circle at 56.05,53.04 radius 7.49
Outline: circle at 16.12,93.2 radius 7.49
Outline: circle at 56.12,13.2 radius 7.49
Copper layers (1*16): Top 0.035mm / dielectric 1.5mm / Bottom 0.035mm
Design rules "default": minimum track width 6mil, minimum drill 0.35mm, track to track 6mil, track to pad 6mil, pad to pad 6mil, via to via 6mil, smd to smd 6mil, copper to edge 40mil, drill to drill 6mil, minimum pad ring 10mil, minimum via ring 8mil, stop-mask expansion 4mil, vias tented up to drill 0mil, thermal gap 10mil

### Footprints (pad centres in the part's own frame; a part is rotated, then mirrored left to right if it is on the bottom)
0603-CAP = smd 1.1 x 1: 1 -0.85,0; 2 0.85,0
DIL-2MM-2X10 = drill 0.711 square: 1 -9,-1 | drill 0.711: 2 -9,1; 3 -7,-1; 4 -7,1; 5 -5,-1; 6 -5,1; 7 -3,-1; 8 -3,1; 9 -1,-1; 10 -1,1; 11 1,-1; 12 1,1; 13 3,-1; 14 3,1; 15 5,-1; 16 5,1; 17 7,-1; 18 7,1; 19 9,-1; 20 9,1
SMT-JUMPER_3_1-NC_TRACE_NO-SILK = smd 0.635 x 1.27: 1 -1.016,0; 2 0,0; 3 1.016,0
SMT-JUMPER_2_NC_TRACE_NO-SILK = smd 0.635 x 1.27: 1 -0.508,0; 2 0.508,0
1X06-1MM = smd 0.6 x 1.55: 1 -2.54,1.27; 2 -1.54,1.27; 3 -0.54,1.27; 4 0.46,1.27; 5 1.46,1.27; 6 2.46,1.27 | smd 1.2 x 1.8: P$1 -3.84,-0.955; P$2 3.76,-0.955
LED1206FAB = smd 1.27 x 1.905: 1 -1.651,0; 2 1.651,0
M0805 = smd 1.3 x 1.6: 1 -0.95,0; 2 0.95,0
0603-RES = smd 1.1 x 1: 1 -0.85,0; 2 0.85,0
EXB38V = smd 0.6 x 0.8: 1 -1.275,-0.75; 4 1.275,-0.75; 5 1.275,0.75; 8 -1.275,0.75 | smd 0.5 x 0.8: 2 -0.4,-0.75; 3 0.4,-0.75; 6 0.4,0.75; 7 -0.4,0.75
SW_JS207011SCQNR = smd 2.5 x 1.2: 1 -2.75,4; 2 -2.75,2; 3 -2.75,-2; 4 -2.75,-4; 5 2.75,4; 6 2.75,2; 7 2.75,-2; 8 2.75,-4 | hole 0.9: 0,5; 0,-5
TACTILE_SWITCH_SMD_5.2MM = smd 1.524 x 0.762: 1 -2.794,1.905; 2 2.794,1.905; 3 -2.794,-1.905; 4 2.794,-1.905
CTS-219-10 = smd 1.13 x 2.44: 1 -11.43,-4.3; 2 -8.89,-4.3; 3 -6.35,-4.3; 4 -3.81,-4.3; 5 -1.27,-4.3; 6 1.27,-4.3; 7 3.81,-4.3; 8 6.35,-4.3; 9 8.89,-4.3; 10 11.43,-4.3; 11 11.43,4.3; 12 8.89,4.3; 13 6.35,4.3; 14 3.81,4.3; 15 1.27,4.3; 16 -1.27,4.3; 17 -3.81,4.3; 18 -6.35,4.3; 19 -8.89,4.3; 20 -11.43,4.3
B3F-1000 = drill 1 pad 1.6: 1 -3.25,2.25; 2 3.25,2.25; 3 -3.25,-2.25; 4 3.25,-2.25
DTSM-3 = smd 2 x 2: 1 -3,0; 2 3,0
QFN-28 = smd 0.85 x 0.2: 1 -1.975,1.2; 2 -1.975,0.8; 3 -1.975,0.4; 4 -1.975,0; 5 -1.975,-0.4; 6 -1.975,-0.8; 7 -1.975,-1.2; 15 1.975,-1.2; 16 1.975,-0.8; 17 1.975,-0.4; 18 1.975,0; 19 1.975,0.4; 20 1.975,0.8; 21 1.975,1.2 | smd 0.2 x 0.85: 8 -1.2,-1.975; 9 -0.8,-1.975; 10 -0.4,-1.975; 11 0,-1.975; 12 0.4,-1.975; 13 0.8,-1.975; 14 1.2,-1.975; 22 1.2,1.975; 23 0.8,1.975; 24 0.4,1.975; 25 0,1.975; 26 -0.4,1.975; 27 -0.8,1.975; 28 -1.2,1.975 | smd 2.65 x 2.65: 29 0,0

### Placement (x,y rotation side)
C1  29.32,33.83 90 top
C2  38.35,26.05 0 top
C3  43.36,86.91 0 top
C4  42.11,34.01 270 top
C5  39.67,108.37 90 top
C6  35.8,80.26 270 top
C7  27.68,117.43 90 top
C8  41.83,118.12 270 top
C9  27.05,85.28 90 top
J3  67.08,109.29 90 top
JP1  51.59,78.05 270 top
JP6  35.65,108.97 270 top
JP7  33.39,125 90 top
JP8  32.62,41.02 180 top
JP9  35.83,26.24 0 top
JP10  32.36,81.62 270 top
JP11  32.65,98.58 90 top
M_01  68.31,13.26 90 top
M_02  28.23,13.26 90 top
M_03  68.31,53.27 90 top
M_04  28.23,53.27 90 top
M_05  68.31,93.27 90 top
M_06  68.31,133.28 90 top
M_07  28.23,93.27 90 top
M_08  28.23,133.28 90 top
POWE_3.3  17.24,114.61 0 top
R1  41.29,19.92 0 top
R2  2.8,19.9 0 top
R3  41.39,59.59 0 top
R4  3.8,60.25 0 top
R5  42.51,100.28 0 top
R6  2.82,100.28 0 top
R7  46.85,140.16 180 top
R8  3.67,140.16 0 top
R9  38.78,41.93 90 top
R10  36.74,41.93 90 top
R11  34.66,41.93 90 top
R12  33.95,25.42 270 top
R13  32.13,42.8 0 top
R14  38.9,98.43 90 top
R16  39.94,125.1 90 top
R17  37.86,125.11 90 top
R18  35.81,125.1 90 top
R19  33.91,108.37 270 top
R20  36.84,98.43 90 top
R21  37.37,108.4 270 top
R23  34.75,98.43 90 top
R24  27.47,82.76 180 top
R25  33.21,79.76 0 top
R26  33.89,101.05 0 top
R27  12.34,114.66 180 top
R28  12.31,111.04 180 top
RN1  21.84,77.65 0 top
RN2  47.8,76.82 0 top
RN3  28.04,77.68 0 top
S1  52.61,113.78 180 top
S2  55.3,80.06 270 top
STATUS_LED  17.21,111.06 0 top
SW1  36.51,68.38 0 top
SWB_1  44.06,12.93 270 top
SWB_2  5.09,13.19 270 top
SWB_3  43.78,53.39 270 top
SWB_4  5.12,53.19 270 top
SWB_5  44.01,93 270 top
SWB_6  4.99,93.09 270 top
SWB_7  44.01,133.23 270 top
SWB_8  5.12,133.2 270 top
SWITCH_M1  44.08,12.12 90 top
SWITCH_M2  5.09,12.37 90 top
SWITCH_M3  43.78,52.77 90 top
SWITCH_M4  5.08,52.27 90 top
SWITCH_M5  44.01,93.64 90 top
SWITCH_M6  4.99,92.05 90 top
SWITCH_M7  44.03,132.55 90 top
SWITCH_M8  5.12,132.44 90 top
SWR_1  45.81,19.92 180 top
SWR_2  6.92,19.89 180 top
SWR_3  45.96,59.53 180 top
SWR_4  8.19,60.25 180 top
SWR_5  47.36,100.28 180 top
SWR_6  8.49,100.35 180 top
SWR_7  42.31,140.06 0 top
SWR_8  8.04,140.16 180 top
U1  35.85,33.89 0 top
U2  35.85,117.45 0 top
U4  35.85,88.18 0 top

### Tracks (layer width: path | path; a pad name or v marks a point on that pad's centre or on a via)
0_SX1  (via drill 0.35)
  Top 0.2: M_04.6 25.18,55.73 24.73,55.28 24.73,45.9 26.11,44.51 26.73,44.51 27.38,43.86 v27.6,43.86 | U1.27 35.05,38.17 34.65,38.57 32.05,38.57 29.83,40.79 29.83,42.02 v29.67,42.18
  Bottom 0.2: v29.67,42.18 29.01,42.18 27.6,43.59 v27.6,43.86
0_SX2
  Top 0.2: U2.27 35.05,122.41 33.93,123.53 32.97,123.53 32.15,124.35 32.15,134.15 30.57,135.74 M_08.6
1_SX1  (via drill 0.35)
  Top 0.2: M_04.5 25.4,54.73 25.13,54.46 25.13,46.46 v25.41,46.18 | U1.28 34.65,38.01 34.49,38.17 31.79,38.17 29.1,40.86 v29.1,41.4 | v26.09,43.83 25.75,43.83 v24.59,44.98
  Bottom 0.2: v24.59,44.98 24.81,44.98 24.81,45.58 v25.41,46.18 | v29.1,41.4 v29.1,41.41 28.92,41.59 28.92,41.48 26.57,43.83 v26.09,43.83
1_SX2
  Top 0.2: M_08.5 30.81,134.74 31.74,133.8 31.74,124.19 32.8,123.13 33.77,123.13 34.65,122.25 U2.28
1_SX3  (1 unrouted)
2_SX1  (via drill 0.35)  (1 unrouted)
  Top 0.2: U1.1 32.68,35.09 31.87,35.89 v31.87,35.95 | v31.9,29.9 31.88,29.92 31.61,29.92 31.07,30.46 30.02,30.46 | M_02.6 25.78,15.72 25.44,16.06 v25.44,18.4 | v27.29,21.65 27.29,21.81 27.87,22.39 27.87,28.3
  Bottom 0.2: v31.87,35.95 31.87,35.91 32.43,35.35 32.43,30.43 v31.9,29.9 | v25.44,18.4 25.44,19.8 v27.29,21.65
2_SX2  (via drill 0.35)
  Top 0.2: M_06.6 64.97,135.74 64.73,135.5 64.73,129.63 59.56,124.46 47.12,124.46 46.27,123.61 46.27,123 v46.07,122.8 | U2.1 32.23,118.65 32.14,118.74 32.14,121.03 32.84,121.73 v32.98,121.73
  Bottom 0.2: v46.07,122.8 44.29,122.8 43.52,122.03 33.28,122.03 v32.98,121.73
2_SX3  (1 unrouted)
3.3V  (via drill 0.35)
  Top 0.2: U2.18 38.99,117.45 40.51,118.97 C8.1 | C7.1 27.75,116.65 29.4,116.65 30.21,117.45 U2.4 | R19.2 37.34,107.52 R21.2 38.43,107.55 | 38.43,107.55 38.53,107.55 38.53,109.56 36.25,111.84 U2.12 | U4.18 40.04,88.18 41.3,86.91 C3.1 | C9.1 27.24,84.44 27.26,84.45 30.98,88.18 U4.4 | R26.2 34.75,101.03 R23.2 34.88,99.28 R20.2 36.98,99.28 38.76,99.28 R14.2 | C4.1 41.64,34.87 40.66,33.89 U1.18 | U1.4 31.65,33.89 30.74,32.98 C1.1 | R18.2 35.82,125.96 R17.2 39.93,125.96 R16.2 | U4.12 36.25,83.81 34.06,81.63 R25.2 | U1.12 36.25,30.5 37.5,29.25 C2.1 37.5,25.99 | 39.6,107.39 39.6,107.44 C5.1 38.43,107.52 38.43,107.55 | 17.51,78.22 17.54,78.25
  Top 0.305: 37.5,25.99 37.5,24.79 37.28,24.57 34.12,24.57 R12.2 | 34.45,79.76 34.13,79.76 R25.2 | R26.2 34.74,99.43 34.88,99.28 | R23.2 36.98,99.28 | R20.2 38.76,99.28 | R19.2 39.47,107.52 39.6,107.39 | R18.2 R16.2 | S2.1 S2.2 57.21,76.68 | 28.59,42.74 30.17,44.32 32.83,44.32 | 32.83,44.32 32.98,44.18 R13.2 | 32.83,44.32 33.11,44.32 36.11,44.32 38.94,44.32 | 36.16,58.93 36.16,59.12 | 36.17,59.1 36.17,59.12 36.16,59.12 | 53.85,76.04 55.34,76.04 55.45,76.16 56.6,76.16 56.65,76.11 56.73,76.2 | 52.88,75.09 52.62,75.09 | 50.25,80.65 50.25,81 | 50.25,81 50.27,81.02 | 50.25,81 50.25,84.68 | 44.01,89.57 44.8,89.57 45.78,88.6 46.34,88.6 46.54,88.4 | C9.1 21.3,84.43 21.23,84.43 | 17.54,80.83 17.51,80.8 17.51,78.39 | 22.74,60.1 29.96,60.1 30.93,59.12 31.14,59.12 36.16,59.12 | 19.03,74.51 19.03,74.31
  Top 0.4: 39.63,43.63 43.49,47.49 43.49,49.49 SWITCH_M3.1 43.78,51.57 43.97,51.76 44.09,51.76 46.03,53.7 SWB_3.1 | SWITCH_M5.1 43.99,90.66 43.99,91.96 46.26,94.23 SWB_5.1 | R14.2 40.24,97.94 40.24,93.87 43.48,90.64 SWITCH_M5.1 | C3.1 42.51,88.08 44.01,89.57 SWITCH_M5.1 | C8.1 42.85,118.97 43.29,118.53 43.29,115.95 41.94,114.6 41.94,107.49 41.89,107.44 39.75,107.44 C5.1 | R19.2 32.48,107.52 31.57,108.42 31.57,112.29 29.24,114.62 28.7,114.62 27.68,115.65 C7.1 27.6,116.5 26.17,116.5 19.49,123.18 12.25,123.18 6,129.44 SWITCH_M8.1 | SWITCH_M8.1 5.12,131.2 7.37,133.45 SWB_8.1 | R16.2 40.34,126.35 40.34,128.14 40.98,128.78 42.25,128.78 43.03,129.55 SWITCH_M7.1 | SWITCH_M7.1 46.26,131.77 SWB_7.1 | v43.47,119.58 42.42,119.58 C8.1 | SWITCH_M7.1 44.03,123.56 47.31,120.28 v47.31,119.58 | S2.1 58.17,83.82 68.5,83.82 v69.68,85 | SWITCH_M6.1 4.99,91.19 7.24,93.44 SWB_6.1 6.91,96.34 5.37,97.88 5.37,115.07 | 34.06,79.69 34.13,79.76 | 34.06,79.69 R25.2 35.41,81.11 C6.1 36.16,81.47 36.16,82.08 36.51,82.44 36.86,82.79 36.87,82.79 36.87,82.8 37.87,82.8 42.76,82.8 43.76,82.8 43.89,82.8 44.52,82.16 44.52,78.22 45.15,77.59 46.51,77.59 RN2.8 RN2.7 47.4,79.5 48.55,80.65 50.25,80.65 | 28.56,78.55 26.89,78.55 RN3.8 RN3.7 RN3.5 29.44,78.55 | RN3.6 28.56,78.55 | 28.56,78.55 29.44,78.55 | 29.44,78.55 31.38,78.55 | 31.38,78.55 32.92,78.55 34.06,79.69 | 38.85,42.85 R9.2 R10.2 R11.2 34.63,42.8 R13.2 32.98,44.19 33.11,44.32 38.94,44.32 39.63,43.63 | 38.85,42.85 39.63,43.63 | 36.11,44.32 36.11,58.93 | 36.17,58.93 36.17,59.1 | 57.21,76.68 56.73,76.2 56.45,76.2 56.44,76.2 54.05,76.2 53.95,76.1 53.91,76.1 53.85,76.04 53.83,76.04 52.88,75.09 52.88,64.2 50.33,61.65 38.89,61.65 36.17,58.93
  Top 0.4: 52.62,75.09 51.43,75.09 50.25,76.27 50.25,80.65 | 50.25,80.65 50.25,84.68 46.54,88.4 46.39,88.55 45.76,88.55 44.51,89.8 44.51,90.14 SWITCH_M5.1 | RN1.5 23.03,78.31 | 17.54,78.25 17.54,80.83 | 17.64,80.93 21.14,84.43 21.3,84.43 | 21.23,84.43 21.26,84.45 27.26,84.45 | 17.51,78.22 17.51,76.03 19.03,74.51 | 19.03,74.31 19.03,73.77 19.04,73.77 19.04,72.76 19.03,72.75 19.03,63.86 22.74,60.15 29.98,60.15 31.19,58.93 31.33,58.93 | 31.14,59.12 31.33,58.93 | 31.33,58.93 36.11,58.93 | 36.11,58.93 36.16,58.93 36.17,58.93 | SWB_1.1 46.31,13.58 44.08,11.36 SWITCH_M1.1 39.11,14.09 39.11,14.88 34.12,19.87 34.12,19.88 | 34.12,19.88 34.12,24.57 | 9.51,7.01 7.79,8.74 6.85,8.74 6.21,9.37 SWITCH_M2.1 5.09,11.39 7.34,13.64 SWB_2.1 8.71,17.81 8.71,18.17 10.96,20.42 10.96,21.54 11.29,21.87 15.11,21.87 15.35,21.91 16.88,21.91 17.12,21.87 22.96,21.87 25,19.83 34.07,19.83 34.12,19.88 | 17.51,78.39 17.52,78.4 RN1.8 RN1.7 RN1.5 | SWB_4.1 7.37,52.75 5.74,51.12 5.24,51.12 5.08,50.96 SWITCH_M4.1 10,44.35 23.63,44.35 25.43,42.55 27.27,42.55 | 27.27,42.55 28.4,42.55 28.59,42.74 | C1.1 27.53,32.98 27.17,32.63 | R12.2 32.35,24.57 32.02,24.89 32.02,26.52 27.17,31.37 27.17,32.63 | 27.17,32.63 27.17,42.45 27.27,42.55 | C4.1 43.6,34.86 44.19,35.46 44.19,39.54 44.18,39.55 44.18,40.62 41.96,42.85 38.85,42.85 | SWITCH_M8.1 5.37,129.19 5.37,115.07 | RN1.6 RN1.5 | 31.38,78.55 31.37,78.56 31.37,80.45 29.97,81.86 26.85,81.86 26.62,82.09 R24.2 26.62,84.01 C9.1 | R27.2 5.78,114.66 5.37,115.07
  Bottom 0.4: v43.47,119.58 v47.31,119.58 49.11,121.38 66.6,121.38 68.05,119.93 68.05,118.32 J3.19 69.66,118.29 70.57,117.38 70.57,85.89 v69.68,85
3_SX1  (via drill 0.35)  (1 unrouted)
  Top 0.2: M_02.5 25.4,14.72 25.04,15.08 25.04,17.43 v24.76,17.71 | 29.85,30.86 v31.63,30.86 | U1.2 32.06,34.69 v31.75,34.99 | v26.34,21.8 27.47,22.94 27.47,28.47
  Bottom 0.2: v31.63,30.86 31.75,30.98 v31.75,34.99 | v26.34,21.8 26.34,21.26 24.77,19.69 v24.77,17.72 v24.76,17.71
3_SX2  (via drill 0.35)
  Top 0.2: M_06.5 66.89,134.58 65.13,134.58 65.13,129.47 59.73,124.06 47.76,124.06 47.76,124.05 v47.01,123.3 | v32.11,122.43 31.74,122.06 31.74,119.68 31.73,119.67 31.73,118.58 32.06,118.25 U2.2
  Bottom 0.2: v32.11,122.43 43.36,122.43 44.4,123.48 46.83,123.48 v47.01,123.3
3_SX3  (1 unrouted)
4_SX1  (via drill 0.35)  (1 unrouted)
  Top 0.2: U1.5 31.92,33.49 | M_02.4 25.59,13.72 24.6,14.71 24.6,16.92 24.08,17.43 24.08,17.99 24.09,18 v24.09,18.39 | v25.38,21.54 25.66,21.82 25.66,22.09 27.07,23.49 27.07,28.64
  Bottom 0.2: v24.09,18.39 24.37,18.67 24.37,19.86 25.38,20.87 v25.38,21.54
4_SX2  (via drill 0.35)
  Top 0.2: U2.5 31.53,117.05 31.1,116.62 31.05,116.62 v30.98,116.68 | M_06.4 65.9,133.74 65.53,133.37 65.53,129.3 59.89,123.66 48.3,123.66 47.93,123.29 v47.93,122.74 | v31.32,123.23 31.32,119.93 v31.02,119.63
  Bottom 0.2: v31.32,123.23 31.44,123.11 32.4,123.11 32.67,122.83 43.19,122.83 44.24,123.88 46.64,123.88 46.73,123.97 47.39,123.97 47.93,123.44 v47.93,122.74 | v30.98,116.68 30.98,119.59 v31.02,119.63
4_SX3  (via drill 0.35)
  Top 0.2: v29.47,85.41 29.47,85.72 31.53,87.78 U4.5 | JP1.1 50.81,79.85 50.81,81.78 50.95,81.93 v51.03,81.93 | v33.43,91.91 31.86,90.33 28.16,90.33 27.99,90.16 27.99,87.31 28.08,87.21 v28.29,87.21
  Bottom 0.2: v51.03,81.93 47.36,85.61 47.36,90.21 45.72,91.84 33.5,91.84 v33.43,91.91 | v28.29,87.21 28.29,86.59 v29.47,85.41
5_SX1  (via drill 0.35)
  Top 0.2: M_04.4 26.05,53.73 25.53,53.21 25.53,47.41 v26.01,46.93 | U1.6 32.51,33.09 v31.07,31.65 | v28.14,41.25 30.7,38.69 v30.7,36.71
  Bottom 0.2: v26.01,46.93 26.09,46.85 26.09,45.83 25.29,45.04 25.29,43.51 25.77,43.03 26.28,43.03 28.07,41.25 v28.14,41.25 | v30.7,36.71 31.07,36.34 v31.07,31.65
5_SX2  (via drill 0.35)
  Top 0.2: M_08.4 30.46,133.74 30.64,133.55 30.64,120.32 30.24,119.92 v30.24,119.03 | v30.74,115.73 31.09,115.73 32.02,116.65 U2.6
  Bottom 0.2: v30.74,115.73 30.67,115.73 30.22,116.18 30.22,119.01 v30.24,119.03
5_SX3  (via drill 0.35)
  Top 0.2: U4.6 32.09,87.38 v30.42,85.71 | R28.2 11.46,107.32 v12,106.78
  Bottom 0.2: v30.42,85.71 29.02,87.11 29.02,103.15 25.39,106.78 v12,106.78
6_SX1  (via drill 0.35)
  Top 0.2: SWITCH_M2.2 4.03,16.44 SWB_2.3 3.43,17.02 3.43,19.58 R2.2 SWR_2.2 5.97,20.76 7.59,22.37 23.72,22.37 v23.79,22.44 | U1.7 33.21,32.69 33.13,32.69 32.9,32.46 32.9,30.18 v33.03,30.06
  Bottom 0.2: v23.79,22.44 23.83,22.48 29.7,22.48 30.85,23.63 30.85,28.1 31.97,29.22 32.19,29.22 v33.03,30.06
6_SX2  (via drill 0.35)
  Top 0.2: 33.83,116.2 U2.7 32.22,116.25 31.03,115.05 v29.97,115.05 | R6.2 3.72,100.23 3.72,98.33 2.74,97.36 SWB_6.3 3.7,96.34 SWITCH_M6.2 | R6.2 3.84,100.35 | SWR_6.2 7.61,100.42 | 7.61,100.42 9.77,102.58 24.09,102.58 28.49,106.98 28.49,111.49 27.03,112.95 27.03,113.37 26.98,113.42 v26.98,113.7 | R6.2 3.77,103.37 v3.84,103.45 | v7.24,103.45 7.61,103.08 7.61,100.42
  Bottom 0.2: v29.97,115.05 29.28,114.37 27.44,114.37 27.02,113.95 27.02,113.74 v26.98,113.7 | v3.84,103.45 v7.24,103.45
6_SX3  (via drill 0.35)
  Top 0.2: SW1.20 21.27,72.68 20.57,73.39 RN1.1 18.57,76.9 v18.46,77.01 | U4.7 33.85,86.95 32.3,86.95 31.33,85.98 v31.33,85.14 | v18.32,79.79 18.32,79.91 19.46,81.06 v27.3,81.06
  Bottom 0.2: v31.33,85.14 31.33,84.04 28.35,81.06 v27.3,81.06 | v18.46,77.01 18.32,77.16 v18.32,79.79
7_SX1  (via drill 0.35)
  Top 0.2: SWR_4.2 R4.2 4.75,58.32 SWB_4.3 3.91,56.44 SWITCH_M4.2 | U1.8 34.65,29.88 33.95,29.18 v33.53,29.18 | v31.66,36.91 31.66,36.71 30.99,36.03 30.42,36.03 30.03,36.43 30.03,38.47 28.21,40.29 v28.03,40.29
  Bottom 0.2: v33.53,29.18 33.53,29.61 33.7,29.78 33.7,30.34 32.83,31.21 32.83,35.95 32.16,36.63 31.94,36.63 v31.66,36.91 | SWB_4.3 1.77,55.34 1.77,45.42 2.56,44.62 2.56,44.59 3.59,43.56 24.67,43.56 25.6,42.63 25.73,42.63 26,42.36 26,42.32 v28.03,40.29
7_SX2  (via drill 0.35)
  Top 0.2: SWR_8.2 R8.2 4.07,139.62 4.07,137.66 SWB_8.3 4.11,136.45 SWITCH_M8.2 | U2.8 34.65,114.16 34.01,113.52 32.15,113.52 v32.15,113.62 | v27.99,113.64 18.95,122.68 11.54,122.68 v7.73,126.5 7.66,126.56
  Bottom 0.2: v27.99,113.64 v28,113.65 32.12,113.65 v32.15,113.62 | v7.73,126.5 3.31,126.5 1.86,127.94 1.86,129.4 1.77,129.5 1.77,135.35 SWB_8.3
7_SX3  (via drill 0.35)
  Top 0.2: 27.62,73.11 27.62,73.25 | 27.62,73.11 26.51,74.21 22.61,74.21 21.44,75.38 RN1.2 21.44,77.15 20.91,77.68 19.3,77.68 v19.24,77.62 | 27.62,73.11 SW1.19 | v24.91,80.38 24.7,80.59 19.7,80.59 19.27,80.17 v19.27,79.74 | v32.3,85.07 34.3,85.07 34.65,85.42 U4.8
  Bottom 0.2: v24.91,80.38 24.94,80.35 28.24,80.35 32.3,84.41 v32.3,85.07 | v19.27,79.74 19.24,79.71 v19.24,77.62
8_SX1
  Top 0.2: SWITCH_M1.2 42.87,15.12 SWB_1.3 41.81,19.49 R1.2 | R1.2 SWR_1.2 | U1.13 36.65,30.66 42.36,24.95 42.36,20.04 R1.2
8_SX2  (via drill 0.35)
  Top 0.2: SWB_5.3 43.62,96.25 SWITCH_M5.2 43.46,97.19 R5.2 SWR_5.2 46.41,100.63 46.77,100.99 46.77,101.72 v47,101.95 | U2.13 36.65,114.78 v40.33,111.11
  Bottom 0.2: v40.33,111.11 41.01,111.11 47,105.11 v47,101.95
8_SX3  (via drill 0.35)
  Top 0.2: SW1.18 29.83,72.68 27.9,74.61 22.78,74.61 22.24,75.15 RN1.3 22.24,77.45 22.43,77.64 23.54,77.64 24.07,78.18 v24.07,79.51 | U4.13 36.65,85.49 37.04,85.1 v39.3,85.1
  Bottom 0.2: v39.3,85.1 39.04,84.84 33.33,84.84 27.99,79.51 v24.07,79.51
9_SX1  (via drill 0.35)
  Top 0.2: SWR_3.2 44.95,59.59 R3.2 41.53,58.78 SWB_3.3 42.4,55.77 SWITCH_M3.2 43.78,56.75 45.01,57.98 47.42,57.98 47.42,46.91 v47.64,46.69 | U1.14 37.05,31.61 37.33,31.33 40.89,31.33 42.52,29.7 42.52,26.24 v42.38,26.09
  Bottom 0.2: v42.38,26.09 43.6,26.09 44.52,27.01 44.52,35.54 42.64,37.42 42.64,39.82 47.67,44.86 47.67,46.66 v47.64,46.69
9_SX2  (via drill 0.35)
  Top 0.2: R7.2 43.36,140.16 SWR_7.2 43.26,137.98 SWB_7.3 42.66,135.58 44,135.58 SWITCH_M7.2 | U2.14 38.19,114.35 v38.21,114.35 | v42.09,126.59 42.06,126.56 42.06,122.32 42.45,121.93 44.65,121.93 46.27,120.31 46.27,115.6 46.23,115.56 v46.23,115.43
  Bottom 0.2: v38.21,114.35 38.6,114.35 38.94,114.69 43.05,114.69 44.12,115.75 44.52,115.75 44.5,115.78 45.88,115.78 v46.23,115.43 | v42.09,126.59 42.09,127.01 40.19,128.91 40.19,134.92 SWB_7.3
9_SX3  (via drill 0.35)
  Top 0.2: 32.7,73.43 SW1.17 30.37,75.01 23.42,75.01 23.12,75.32 RN1.4 23.46,77.24 23.71,77.24 24.75,78.29 v24.75,78.68 | 37.05,85.78 U4.14 37.05,85.78 39.64,85.78 v40.34,85.08
  Bottom 0.2: v24.75,78.68 25.18,79.11 28.19,79.11 33.5,84.42 38.28,84.42 40.25,84.42 40.34,84.51 v40.34,85.08
10_SX1  (via drill 0.35)  (1 unrouted)
  Top 0.2: M_01.6 65.64,15.72 65.5,15.86 65.5,17.6 64.27,18.83 64.27,18.86 60.49,22.64 45.76,22.64 44.5,23.89 | v43.05,25.05 v43.05,25.06 43.05,29.8 40.16,32.69 U1.15
  Bottom 0.2: 44.41,24.07 v44.5,24.07 43.29,24.07 43.05,24.32 v43.05,25.05 v43.04,25.05
10_SX2  (via drill 0.35)
  Top 0.2: M_05.6 65.67,95.73 65.57,95.84 65.57,97.21 58.82,103.95 50.14,103.95 49.44,104.65 49.44,106.23 v49.41,106.26 | v43.81,114.28 43.81,111.42 45.97,109.26 v46.07,109.26 | v38.88,113.67 38.88,116 38.63,116.25 U2.15
  Bottom 0.2: v43.81,114.28 43.8,114.29 39.32,114.29 38.88,113.85 v38.88,113.67 | v49.41,106.26 47.99,106.26 46.07,108.18 v46.07,109.26
10_SX3  (via drill 0.35)
  Top 0.2: SW1.16 34.91,72.68 32.18,75.41 27.18,75.41 26.78,75.81 26.78,76.92 RN3.1 26.16,76.93 25.45,77.64 25.45,79.25 26.33,80.13 30.01,80.13 30.14,80 v30.54,80 | v41.37,84.9 41.17,85.1 41.17,85.26 39.45,86.98 U4.15
  Bottom 0.2: v30.54,80 30.91,80.37 30.91,81.26 33.61,83.96 40.76,83.96 41.37,84.57 v41.37,84.9
11_SX1
  Top 0.2: M_01.5 65.56,14.72 65.1,15.18 65.1,17.44 60.3,22.24 45.33,22.24 43.75,23.82 43.75,29.67 40.34,33.09 U1.16
11_SX2  (via drill 0.35)
  Top 0.2: M_05.5 65.28,94.73 65.12,94.89 65.12,97.02 58.58,103.55 49.95,103.55 48.72,104.78 v48.72,105.5 | v39.85,113.59 39.77,113.67 39.77,114.04 39.69,113.96 39.69,116.65 U2.16 | v45.37,108.51 45.37,109.13 43.25,111.25 43.25,113.45 v43.13,113.57
  Bottom 0.2: v39.85,113.59 39.88,113.62 43.08,113.62 v43.13,113.57 | v45.37,108.51 45.37,108.11 47.98,105.5 v48.72,105.5
11_SX3  (via drill 0.35)
  Top 0.2: SW1.15 37.45,72.68 34.32,75.81 27.89,75.81 27.71,75.99 27.71,76.86 RN3.2 27.37,77.21 27.37,77.46 27.19,77.63 26.03,77.63 25.88,77.78 25.88,79.05 26.45,79.62 29.73,79.62 v29.55,79.44 | U4.16 39.68,87.38 41.47,85.58 41.95,85.58 42.5,85.03 v42.5,84.8
  Bottom 0.2: v29.55,79.44 29.68,79.31 31,79.31 31.34,79.65 31.34,81.12 33.76,83.55 37.86,83.55 37.87,83.55 41.92,83.55 42.5,84.13 v42.5,84.8
12_SX1  (via drill 0.35)
  Top 0.2: M_01.4 65.08,13.72 64.7,14.09 64.7,17.27 60.14,21.84 44.63,21.84 43.24,23.23 v43.27,23.26 | U1.19 40.04,34.29 41.25,35.5 41.25,36.58 42.41,37.74 v43.33,37.74
  Bottom 0.2: 43.33,37.62 v43.33,37.74 44.25,37.74 44.92,37.07 44.92,24.62 45.18,24.35 45.18,23.79 44.79,23.39 43.41,23.39 v43.27,23.26
12_SX2  (via drill 0.35)
  Top 0.2: M_05.4 65.01,93.73 64.71,94.04 64.71,96.79 58.41,103.08 58.41,103.1 49.7,103.1 48.02,104.78 v47.97,104.78 | U2.19 38.73,117.85 41.16,120.28 43.77,120.28 44.25,119.8 44.25,115.85 42.44,114.04 42.44,111.45 44.39,109.5 v44.39,109.08
  Bottom 0.2: v44.39,109.08 44.39,108.36 v47.97,104.78
12_SX3  (via drill 0.35)
  Top 0.2: 39.99,72.68 40.21,72.68 | 40.21,72.68 SW1.14 | 40.21,72.68 36.69,76.21 28.7,76.21 28.48,76.43 28.48,76.89 RN3.3 28.44,77.49 28.6,77.65 30.94,77.65 v31.06,77.77 | U4.19 | v41.21,87.97 40.61,88.58 40.04,88.58 39.88,88.58 U4.19
  Bottom 0.2: v31.06,77.77 31.33,77.77 31.74,78.18 31.74,80.96 33.93,83.15 37.5,83.15 42.46,83.15 43.48,84.17 v43.48,84.75 44.16,84.75 45.23,85.83 45.23,87 44.26,87.97 v41.21,87.97
13_SX1  (via drill 0.35)
  Top 0.2: M_03.6 67.03,55.71 65.34,55.71 64.67,55.03 64.67,49.32 59.76,44.42 47.97,44.42 v46.95,45.44 46.79,45.44 46.71,45.36 | v40.59,38.68 40.59,38.43 40.55,38.39 40.55,35.55 39.69,34.69 U1.20
  Bottom 0.2: v46.95,45.44 46.95,45.41 46.27,45.41 41.74,40.87 41.74,39.69 40.72,38.68 v40.59,38.68
13_SX2  (via drill 0.35)
  Top 0.2: M_07.6 26.32,95.73 25.58,96.47 25.58,102 29.92,106.35 29.92,111.13 30.41,111.62 v30.63,111.62 | U2.20 38.39,118.25 40.86,120.73 43.92,120.73 44.69,119.96 44.69,115.48 44.43,115.22 v44.43,115.05
  Bottom 0.2: v30.63,111.62 30.9,111.89 46,111.89 46.39,112.28 46.39,114.22 45.56,115.05 v44.43,115.05
13_SX3  (via drill 0.35)
  Top 0.2: SW1.13 42.56,72.68 38.6,76.64 29.61,76.64 RN3.4 29.47,77.08 31.99,77.08 v32.18,77.27 | v39.13,89.37 38.74,88.98 U4.20
  Bottom 0.2: v32.18,77.27 32.18,80.84 34.06,82.72 42.69,82.72 45.68,85.71 45.68,87.15 44.19,88.65 41.3,88.65 40.66,89.29 39.22,89.29 v39.13,89.37 39.16,89.37
14_SX1  (via drill 0.35)
  Top 0.2: M_03.5 65.48,54.73 65.07,54.31 65.07,49.11 59.9,43.94 46.74,43.94 46.36,44.32 v46.17,44.32 | U1.21 37.83,36.02 37.45,36.39 37.45,37.84 39.01,39.4 41.08,39.4 v41.75,38.72
  Bottom 0.2: v41.75,38.72 42.19,39.16 42.19,40.25 46.17,44.23 v46.17,44.32
14_SX2  (via drill 0.35)
  Top 0.2: M_07.5 26.2,94.73 25.13,95.8 25.13,102.27 29.44,106.57 29.44,111.9 v29.69,112.15 | v44.77,114.07 45.11,114.42 45.11,120.19 44.17,121.13 40.65,121.13 38.18,118.65 U2.21
  Bottom 0.2: v44.77,114.07 44.93,114.23 45.64,114.23 45.95,113.91 45.95,112.65 45.72,112.42 29.96,112.42 v29.69,112.15
14_SX3  (via drill 0.35)
  Top 0.2: SW1.12 45.4,74.27 46.53,75.41 RN2.1 46.28,75.82 44.18,75.82 v44.13,75.77 | U4.21 38.76,90.31 v38.76,90.49
  Bottom 0.2: v38.76,90.49 38.88,90.37 39.94,90.37 40.42,90.85 42.55,90.85 46.13,87.27 46.13,85.41 44.81,84.09 44.8,77.41 44.47,77.08 44.47,76.11 v44.13,75.77
15_SX1  (via drill 0.35)
  Top 0.2: M_03.4 66.98,53.66 65.79,53.66 65.47,53.33 65.47,48.84 60.13,43.5 v43.02,43.5 42.97,43.5 | U1.22 37.05,38.01 38.86,39.82 39.29,39.82 40.69,41.23 v40.69,41.68
  Bottom 0.2: v43.02,43.5 42.52,43.5 v40.69,41.68
15_SX2  (via drill 0.35)
  Top 0.2: M_07.4 26.15,93.73 24.73,95.15 24.73,102.59 28.89,106.75 28.89,112.3 v28.58,112.61 | v45.25,113.22 45.55,113.52 45.55,120.45 44.47,121.53 40.36,121.53 39.08,120.25 37.46,120.25 37.05,119.84 U2.22
  Bottom 0.2: v28.58,112.61 28.8,112.61 29.04,112.85 44.88,112.85 v45.25,113.22
15_SX3  (via drill 0.35)
  Top 0.2: SW1.11 47.94,73.42 47.53,73.83 47.53,75.94 RN2.2 47.13,76.35 47.13,76.6 46.95,76.77 45.26,76.77 v45.24,76.79 | v39.63,91.17 39.37,91.43 37.37,91.43 37.05,91.11 U4.22
  Bottom 0.2: v39.63,91.17 39.72,91.25 42.72,91.25 46.61,87.35 46.61,85.17 45.25,83.81 45.25,79.39 45.24,79.38 v45.24,76.79
!INT_SX3
  Top 0.2: U4.9 35.05,83.75 34.07,82.76 R24.1
!RESET_SX1
  Top 0.2: R9.1 38.78,40.39 36.65,38.26 U1.23
!RESET_SX2
  Top 0.2: U2.23 36.65,122.14 37.77,123.26 39.01,123.26 39.94,124.19 R16.1
!RESET_SX3
  Top 0.2: U4.23 36.65,93 38.9,95.25 R14.1
ADDR0_SX1
  Top 0.2: U1.26 35.45,38.56 34.99,39.03 33.68,39.03 33.13,39.57 JP8.1
ADDR0_SX2
  Top 0.2: U2.26 35.45,122.68 34.2,123.93 33.52,123.93 33.28,124.17 | 33.28,124.17 32.96,124.49 | JP7.1 33.39,124.28 33.28,124.17
ADDR0_SX3
  Top 0.2: JP11.1 32.65,98.03 | JP11.1 32.65,97.85 | 32.65,97.65 32.65,95.7 35.45,92.89 U4.26 | 32.65,97.65 32.22,98.07 | JP11.1 32.65,97.65
ADDR1_SX1
  Top 0.2: JP9.1 35.45,26.38 U1.10
ADDR1_SX2  (1 unrouted)
  Top 0.2: U2.10 35.45,109.78 35.22,109.55 35.22,109.48
ADDR1_SX3
  Top 0.2: 31.93,82.13 31.94,82.14 JP10.1 | JP10.1 34.01,82.14 35.45,83.58 U4.10 | JP10.1
GND_MCU  (via drill 0.35)  (29 unrouted)
  Top 0.2: 41.69,117.26 41.68,117.27 C8.2 | C8.2 41.61,117.05 U2.17 37.11,117.05 36.71,117.45 U2.29 35.45,117.85 U2.3 30.09,117.85 29.67,118.28 C7.2 26.96,119 M_08.1 | C9.2 28.38,86.13 30.82,88.58 U4.3 35.45,88.58 U4.29 36.25,87.78 U4.17 39.84,87.78 41.59,86.03 43.38,86.03 44.21,86.87 C3.2 | C4.2 41.57,33.16 41.25,33.49 U1.17 36.25,33.49 U1.29 35.45,34.29 U1.3 31.44,34.29 31.04,34.68 C1.2 | JP9.2 36.33,27.23 v36.68,27.58 | JP7.2 33.39,126.33 39.28,132.22 39.28,137.99 SWR_7.1 | C2.2 40.08,25.17 v40.59,25.17 40.34,24.92 R1.1 | C5.2 39.87,109.41 40.99,109.41 41.44,109.86 41.44,114.81 41.77,115.13 41.77,117.21 C8.2
  Top 0.4: STATUS_LED.2 18.86,114.59 POWE_3.3.2 | SW1.1 SW1.2 SW1.3 SW1.4 SW1.5 SW1.6 SW1.7 SW1.8 SW1.9 SW1.10 | R4.1 2.85,61.95 3.26,62.37 7.99,62.37 9.14,61.22 SWR_4.1 | R5.1 41.56,102.75 48.28,102.75 48.28,100.31 SWR_5.1 48.41,100.18 48.41,97.68 47.47,96.73 47.47,95.23 47.37,95.14 47.37,90.7 47.99,89 52.51,84.49 65.4,84.49 67.04,86.13 M_05.1 | C9.2 26.96,86.22 M_07.1 27.26,91.03 30.74,91.03 31.46,91.75 31.46,103.47 33.1,105.11 41.46,105.11 41.56,105.02 41.56,102.91
  Bottom 0.2: v36.68,27.58 40.26,27.58 40.96,26.88 40.96,25.54 v40.59,25.17
  Bottom 0.4: J3.20 J3.18
  other vias: 35.78,117.37 35.7,33.81 35.75,88.13
  pour Top: -56.18,143.37 -13.85,143.37 -13.85,-15.24 -56.18,-15.24
  pour Bottom: -74.37,153.53 -16.06,153.53 -16.06,-12.44 -74.37,-12.44
INT_01  (1 unrouted)
  Top 0.2: R12.1 33.95,26.75 35.05,27.85 U1.9
INT_02  (1 unrouted)
  Top 0.2: R19.1 35.05,110.36 U2.9
N$5
  Top 0.2: JP6.2 35.7,108.51 36.63,108.51 R21.1
N$8
  Top 0.2: JP8.2 31.89,41.02 31.26,41.64 31.26,42.78 R13.1
N$13
  Top 0.4: R28.1 15.54,111.04 STATUS_LED.1
N$14
  Top 0.2: JP10.2 R25.1
N$15
  Top 0.2: JP11.2 32.65,100.66 R26.1
N$193
  Top 0.4: R27.1 15.53,114.66 POWE_3.3.1
NEOPIXEL_01  (1 unrouted)
NEOPIXEL_02  (1 unrouted)
NEOPIXEL_03  (1 unrouted)
NEOPIXEL_04  (1 unrouted)
NEOPIXEL_05  (1 unrouted)
NEOPIXEL_06  (1 unrouted)
  Top 0.2: M_06.3 66.13,132.74 65.93,132.54
NEOPIXEL_07  (1 unrouted)
NEOPIXEL_08  (1 unrouted)
RESET  (via drill 0.35)  (1 unrouted)
  Top 0.2: RN2.6 48.2,78.6 48.67,79.07 v48.97,79.07 | 51.44,78.2 JP1.2 | S2.3 S2.4 53.2,77.06 51.61,77.06 JP1.3 JP1.2 | v51.48,80.42 52.23,80.42 52.68,79.97 52.68,78.2 52.45,77.97 51.67,77.97 JP1.2
  Bottom 0.2: v48.97,79.07 50.32,80.42 v51.48,80.42
SCL_00  (3 unrouted)
  Top 0.2: U2.25 35.85,123.88 35.73,124 35.73,124.17 R18.1 | U4.25 35.85,93.25 34.75,94.35 R23.1 | U1.25 35.85,39.58 34.66,40.78 R11.1
SDA_00  (3 unrouted)
  Top 0.2: U2.24 36.25,122.4 37.86,124.01 R17.1 | R20.1 36.94,97.48 36.94,93.88 36.25,93.19 U4.24 | U1.24 36.25,38.43 36.74,38.92 R10.1
VCC_5V
  Top 0.4: 55.65,118.07 S1.4 | 67.55,131.74 M_06.2 | 67.5,91.73 M_05.2 | 70.78,51.76 70.78,52.43 70.75,52.45 70.75,60.68 70.68,60.75 | 70.78,51.43 70.78,51.76 | M_03.2 67.08,51.76 67.6,51.76 70.72,51.76 70.78,51.76 | 70.78,51.76 70.73,51.72 70.73,43.9 | 70.73,43.9 70.73,43.75 69.9,42.91 69.29,42.91 69.28,42.9 63.49,42.9 | 70.74,21.07 70.8,11.94 70.76,11.9 | 27.19,51.73 M_04.2 | 31.6,51.73 31.67,51.8 | 25,91.65 24.86,91.51 24.86,89.31 24.76,89.21 | 13.07,77.52 16.57,81.02 | 69.88,42.9 69.88,43.05 70.73,43.9 | 68.48,23.26 68.52,23.26 68.56,23.22 | 70.63,132.38 70.64,132.37
  Top 0.508: M_02.2 28.55,11.72 28.62,11.79 28.96,11.79 33.23,7.52 33.23,1.87 33.78,1.32 68.89,1.32 70.76,3.19 70.76,11.9 | M_01.2 70.58,11.72 70.76,11.9 | 70.76,11.9 70.74,11.92 70.74,21.04 | 70.74,21.04 70.74,21.07 | 70.74,21.04 68.56,23.22 68.5,23.22 | 68.48,23.26 46.58,23.26 44.86,24.98 44.86,26.48 44.85,26.73 44.85,39.55 44.86,39.24 44.86,41.58 46.21,42.93 60.27,42.93 | 60.27,42.93 63.46,42.93 63.49,42.9 69.88,42.9 69.9,42.91 70.73,43.75 70.73,47.26 70.72,47.27 70.72,47.77 70.71,48.28 70.72,48.29 70.72,51.76 | 60.27,42.93 60.23,42.9 | 67.6,51.76 70.78,51.76 70.75,51.79 70.75,60.68 | 70.68,60.75 63.46,60.75 59.17,65.05 59.17,80.97 61.32,83.11 69.75,83.11 70.65,84.02 70.65,91.28 | 55.65,118.07 60.14,122.56 70.4,122.56 70.64,122.33 | M_08.2 26.11,131.74 24.88,132.97 24.88,144.69 25.24,145.05 67.03,145.05 70.63,141.45 | 70.63,141.43 | 70.65,91.28 70.19,91.73 67.5,91.73 | 70.65,91.28 70.65,90.99 70.64,91 70.64,122.33 | 70.63,132.38 70.63,141.43 | 70.63,141.43 | S1.8 47.89,117.78 47.12,117.01 47.12,108.69 44.24,105.81 32.87,105.81 30.8,103.74 30.8,92.02 30.52,91.73 M_07.2 26.5,91.73 | 25,91.65 25.09,91.73 | 25,89.45 24.76,89.21 16.57,81.02 12.98,77.42 12.98,77.37 | 13.07,77.52 13.07,67.33 | 27.19,51.73 31.6,51.73 31.67,51.73 31.67,57.53 29.7,59.49 22.26,59.49 21.81,59.87 19.98,61.7 | 70.64,122.33 70.64,131.64 | 70.64,131.64 70.64,132.36 70.64,132.37 | M_06.2 70.54,131.74 70.64,131.64 | 70.64,132.37 70.64,131.65 70.64,131.64 | 70.63,141.45 70.63,141.43 | 70.63,141.43 70.63,141.45
  Top 0.61: S1.8 51.1,117.78 51.87,117.01 53.34,117.01 54.11,117.78 S1.4 | 22.29,59.53 21.4,60.28 19.98,61.7 16.23,65.45 14.95,65.45 13.07,67.33 13.03,67.38 13.03,77.47 16.57,81.02 25,89.45 25,91.65 | 25.09,91.73 26.5,91.73
VCC_5V_IN
  Top 0.61: S1.7 49.87,115.77 S1.3 56.87,115.78 57.59,116.5 57.59,118.13 61.15,121.69 69.55,121.69 69.55,116.29 J3.17

### Text on the board
tPlace: gnd | gnd | 0 | 0 | 1 | 1 | PIXELS | I2C | ON | 5V | GND | GND | 6 | 2 | 2 | 3 | 3 | 4 | 4 | 5 | 5 | gnd | gnd | 6 | 6 | 7 | 7